# Altium project RK_NVR_DEMO1_RK3588_LP4XD200P232SD8_V21_20211228.PrjPcb (part 17 of 19)

## Sheet 84.PCIE-PCIE3.0_1x4Lanes_RC_64P.SchDoc
size 594 x 420 mm; Revision: V2.1; Schematic Page Number: 11; Page Number: 36; Check: Default; Schematic Name: RK_NVR_DEMO1_RK3588_LP4/4x_V21; Page Count: 43; Page name: 84.PCIE-PCIE3.0_1x4Lanes_RC_64P; Designer: Zhangdz; Schematic Page Count: 99; Revcode: V2.1; DsnPath: E:\Work\SBER\RK3588_SOM\temp\RK_NVR_DEMO1_RK3588_LP4XD200P232SD8_V21_20211228.DSN; SchematicName: RK_NVR_DEMO1_RK3588_LP4/4x_V21; PageName: 84.PCIE-PCIE3.0_1x4Lanes_RC_64P; PageSize: A2; TopSchematic: True
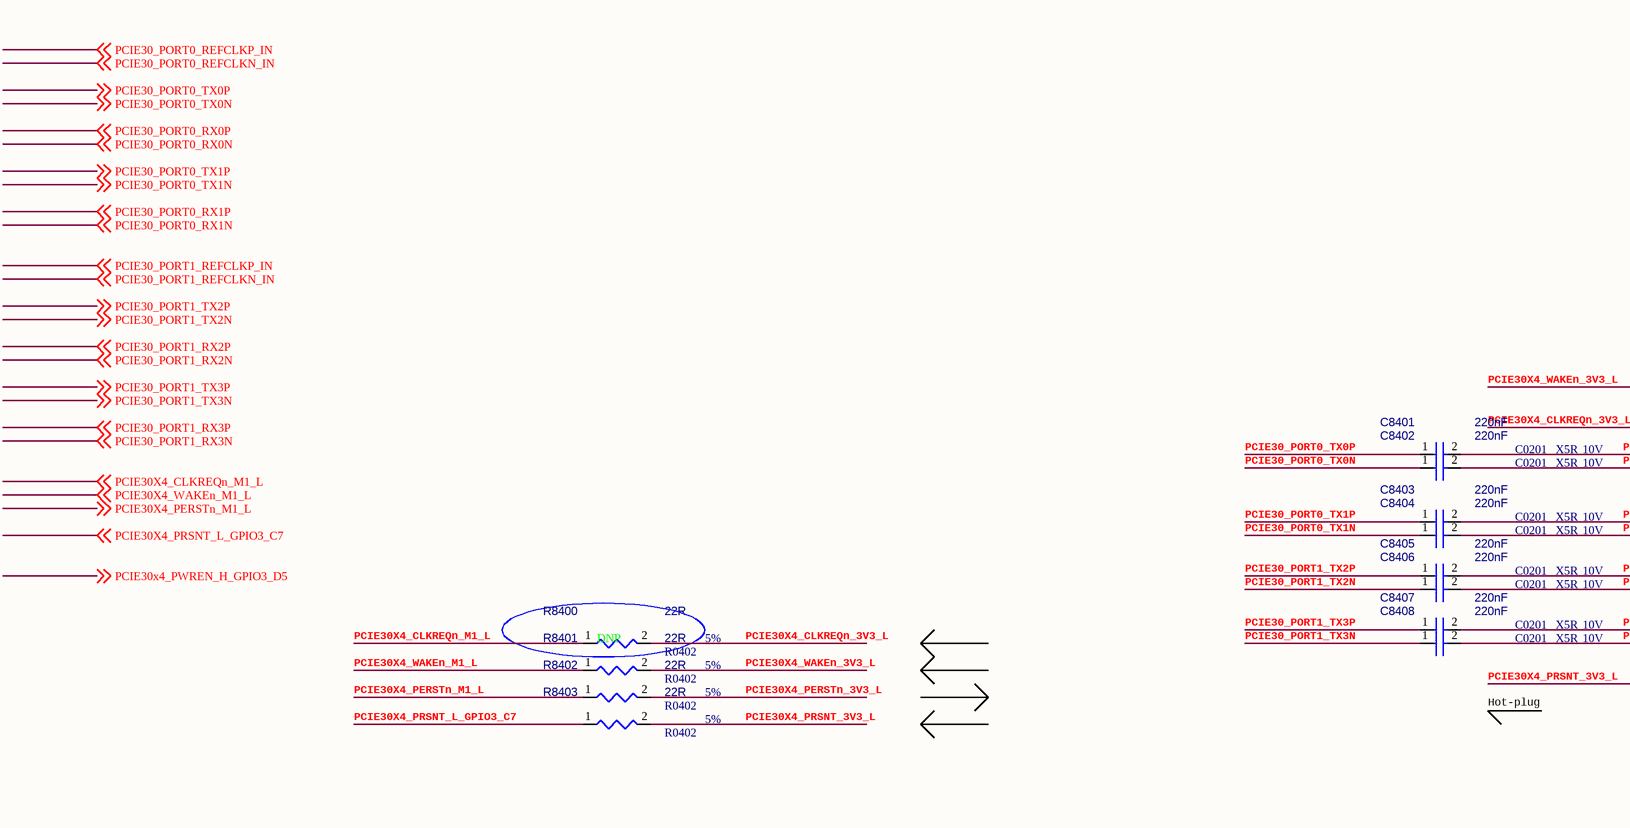
[diagram p69: 84.PCIE-PCIE3.0_1x4Lanes_RC_64P.SchDoc, top left]
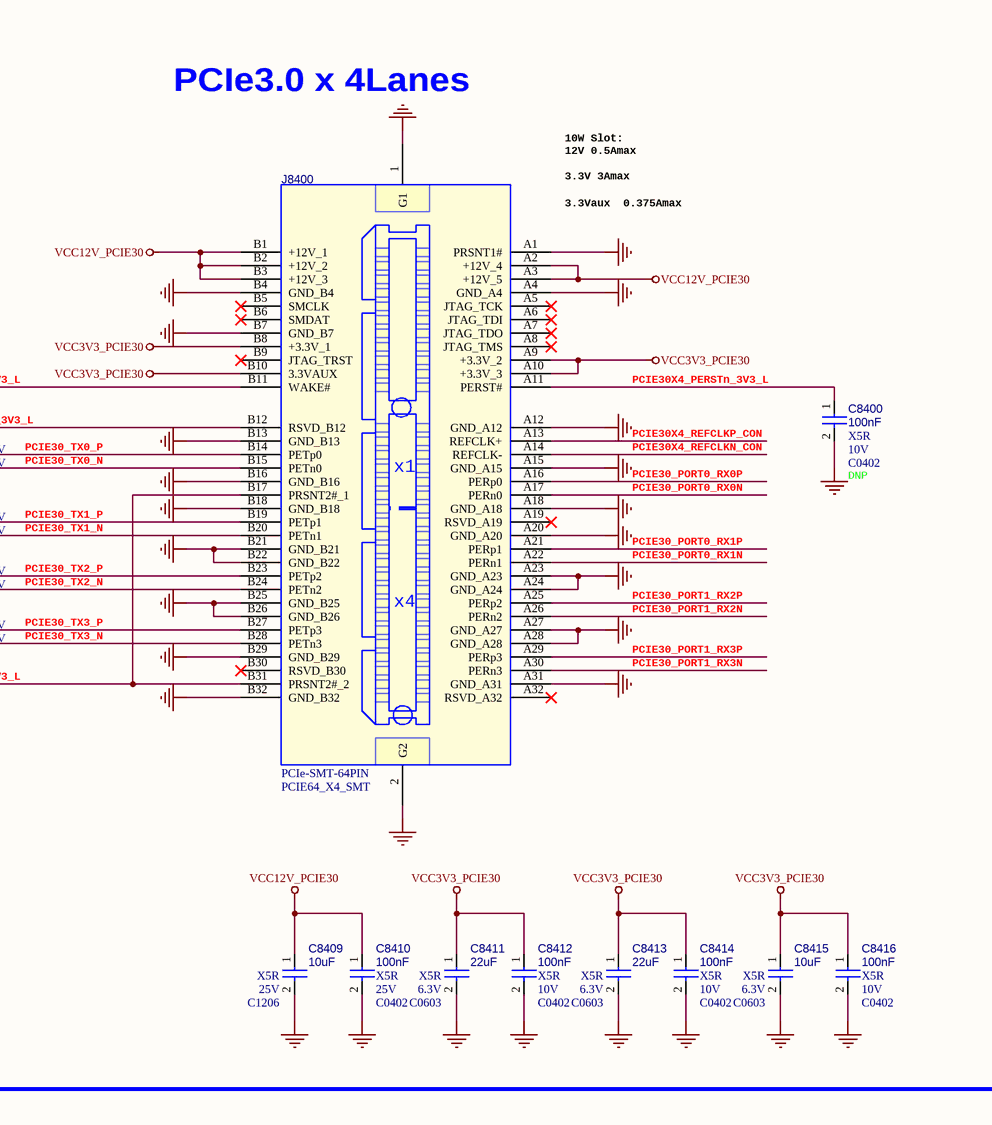
[diagram p70: 84.PCIE-PCIE3.0_1x4Lanes_RC_64P.SchDoc, top right]
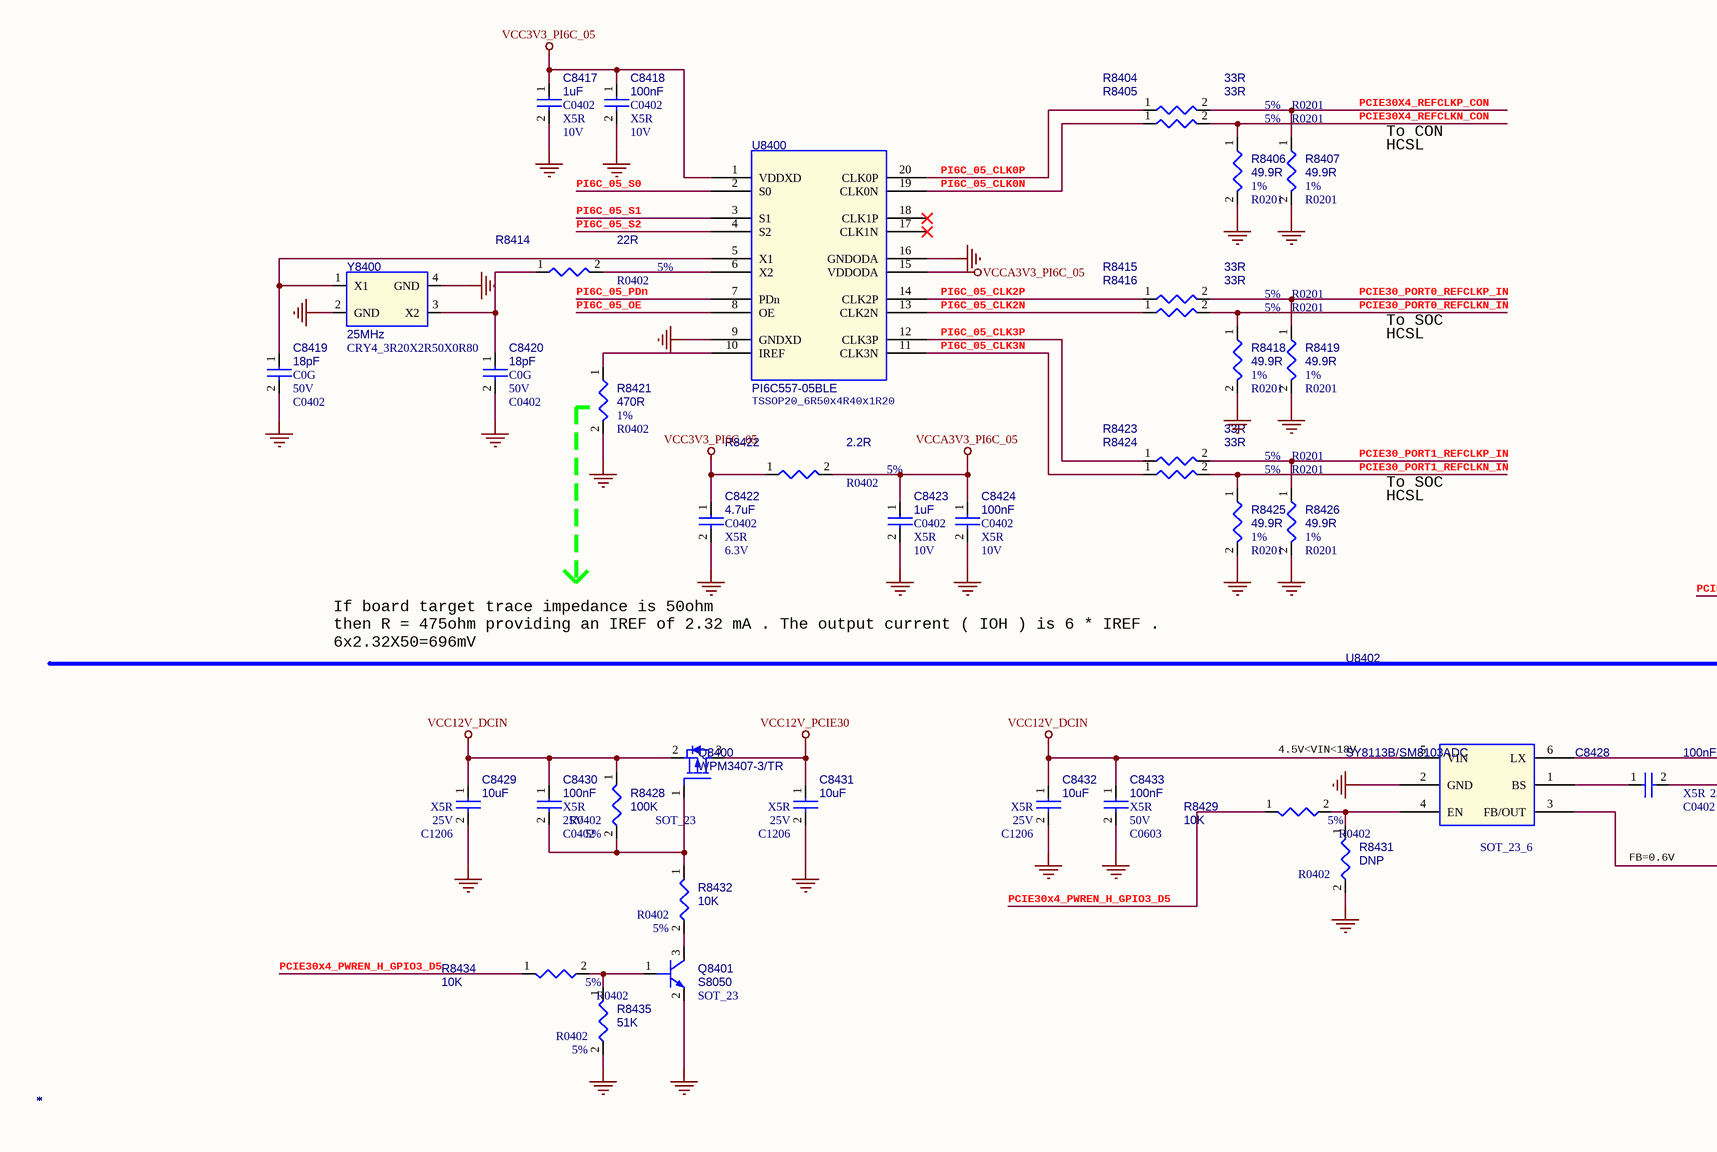
[diagram p71: 84.PCIE-PCIE3.0_1x4Lanes_RC_64P.SchDoc, bottom left]
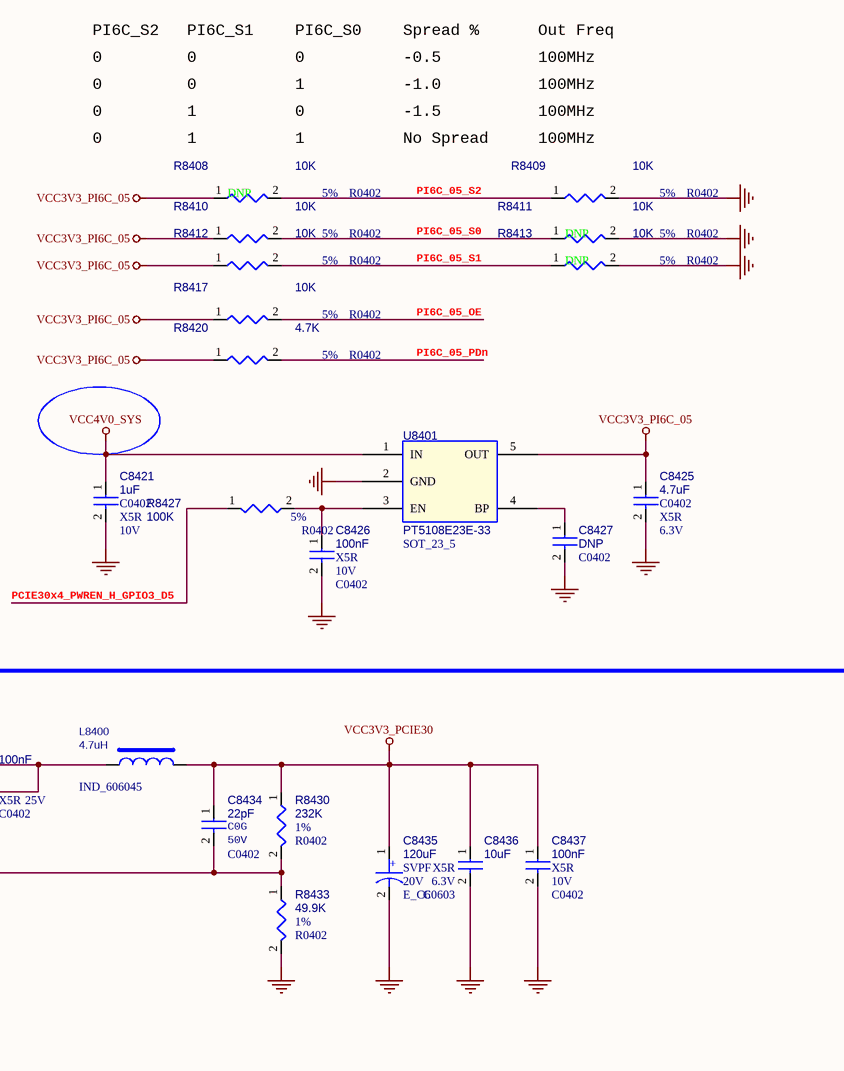
[diagram p72: 84.PCIE-PCIE3.0_1x4Lanes_RC_64P.SchDoc, bottom right]

### Parts
C8400  *  Voltage: 10V  Dielectric: X5R  option: DNP  [C0402]
C8401  *  Voltage: 10V  Dielectric: X5R  [C0201]
C8402  *  Voltage: 10V  Dielectric: X5R  [C0201]
C8403  *  Voltage: 10V  Dielectric: X5R  [C0201]
C8404  *  Voltage: 10V  Dielectric: X5R  [C0201]
C8405  *  Voltage: 10V  Dielectric: X5R  [C0201]
C8406  *  Voltage: 10V  Dielectric: X5R  [C0201]
C8407  *  Voltage: 10V  Dielectric: X5R  [C0201]
C8408  *  Voltage: 10V  Dielectric: X5R  [C0201]
C8409  *  Voltage: 25V  Dielectric: X5R  [C1206]
C8410  *  Voltage: 25V  Dielectric: X5R  [C0402]
C8411  *  Voltage: 6.3V  Dielectric: X5R  [C0603]
C8412  *  Voltage: 10V  Dielectric: X5R  [C0402]
C8413  *  Voltage: 6.3V  Dielectric: X5R  [C0603]
C8414  *  Voltage: 10V  Dielectric: X5R  [C0402]
C8415  *  Voltage: 6.3V  Dielectric: X5R  [C0603]
C8416  *  Voltage: 10V  Dielectric: X5R  [C0402]
C8417  *  Voltage: 10V  Dielectric: X5R  [C0402]
C8418  *  Voltage: 10V  Dielectric: X5R  [C0402]
C8419  *  Voltage: 50V  Dielectric: C0G  [C0402]
C8420  *  Voltage: 50V  Dielectric: C0G  [C0402]
C8421  *  Voltage: 10V  Dielectric: X5R  [C0402]
C8422  *  Voltage: 6.3V  Dielectric: X5R  [C0402]
C8423  *  Voltage: 10V  Dielectric: X5R  [C0402]
C8424  *  Voltage: 10V  Dielectric: X5R  [C0402]
C8425  *  Voltage: 6.3V  Dielectric: X5R  [C0402]
C8426  *  Voltage: 10V  Dielectric: X5R  [C0402]
C8427  *  [C0402]
C8428  *  Voltage: 25V  Dielectric: X5R  [C0402]
C8429  *  Voltage: 25V  Dielectric: X5R  [C1206]
C8430  *  Voltage: 25V  Dielectric: X5R  [C0402]
C8431  *  Voltage: 25V  Dielectric: X5R  [C1206]
C8432  *  Voltage: 25V  Dielectric: X5R  [C1206]
C8433  *  Voltage: 50V  Dielectric: X5R  [C0603]
C8434  *  Voltage: 50V  Dielectric: C0G  [C0402]
C8435  *  Voltage: 20V  Dielectric: SVPF  [E_C6]
C8436  *  Voltage: 6.3V  Dielectric: X5R  [C0603]
C8437  *  Voltage: 10V  Dielectric: X5R  [C0402]
J8400  *  [PCIE64_X4_SMT]
L8400  *  [IND_606045]
Q8400  *  PCB Footprint: SOT_23  [SOT23]
Q8401  *  [SOT_23]
R8400  *  Tolerance: 5%  option: DNP  [R0402]
R8401  *  Tolerance: 5%  [R0402]
R8402  *  Tolerance: 5%  [R0402]
R8403  *  Tolerance: 5%  [R0402]
R8404  *  PCB Footprint: R0201  Tolerance: 5%  [R0402]
R8405  *  PCB Footprint: R0201  Tolerance: 5%  [R0402]
R8406  *  PCB Footprint: R0201  Tolerance: 1%  [R0402]
R8407  *  PCB Footprint: R0201  Tolerance: 1%  [R0402]
R8408  *  Tolerance: 5%  option: DNP  [R0402]
R8409  *  Tolerance: 5%  [R0402]
R8410  *  Tolerance: 5%  [R0402]
R8411  *  Tolerance: 5%  option: DNP  [R0402]
R8412  *  Tolerance: 5%  [R0402]
R8413  *  Tolerance: 5%  option: DNP  [R0402]
R8414  *  Tolerance: 5%  [R0402]
R8415  *  PCB Footprint: R0201  Tolerance: 5%  [R0402]
R8416  *  PCB Footprint: R0201  Tolerance: 5%  [R0402]
R8417  *  Tolerance: 5%  [R0402]
R8418  *  PCB Footprint: R0201  Tolerance: 1%  [R0402]
R8419  *  PCB Footprint: R0201  Tolerance: 1%  [R0402]
R8420  *  Tolerance: 5%  [R0402]
R8421  *  Tolerance: 1%  [R0402]
R8422  *  Tolerance: 5%  [R0402]
R8423  *  PCB Footprint: R0201  Tolerance: 5%  [R0402]
R8424  *  PCB Footprint: R0201  Tolerance: 5%  [R0402]
R8425  *  PCB Footprint: R0201  Tolerance: 1%  [R0402]
R8426  *  PCB Footprint: R0201  Tolerance: 1%  [R0402]
R8427  *  Tolerance: 5%  [R0402]
R8428  *  Tolerance: 5%  [R0402]
R8429  *  Tolerance: 5%  [R0402]
R8430  *  Tolerance: 1%  [R0402]
R8431  *  [R0402]
R8432  *  Tolerance: 5%  [R0402]
R8433  *  Tolerance: 1%  [R0402]
R8434  *  Tolerance: 5%  [R0402]
R8435  *  Tolerance: 5%  [R0402]
U8400  *  PCB Footprint: TSSOP20_6R50x4R40x1R20  [TSSOP20]
U8401  *  [SOT_23_5]
U8402  *  [SOT_23_6]
Y8400  *  PCB Footprint: CRY4_3R20X2R50X0R80  [CRY-3225]

### Nets
GND: C8400.2 C8409.2 C8410.2 C8411.2 C8412.2 C8413.2 C8414.2 C8415.2 C8416.2 C8417.2 C8418.2 C8419.2 C8420.2 C8421.2 C8422.2 C8423.2 C8424.2 C8425.2 C8426.2 C8427.2 C8429.2 C8431.2 C8432.2 C8433.2 C8435.2 C8436.2 C8437.2 J8400.1(G1) J8400.2(G2) J8400.A1(PRSNT1#) J8400.A4(GND_A4) J8400.A12(GND_A12) J8400.A15(GND_A15) J8400.A18(GND_A18) J8400.A20(GND_A20) J8400.A23(GND_A23) J8400.A24(GND_A24) J8400.A27(GND_A27) J8400.A28(GND_A28) J8400.A31(GND_A31) J8400.B4(GND_B4) J8400.B7(GND_B7) J8400.B13(GND_B13) J8400.B16(GND_B16) J8400.B18(GND_B18) J8400.B21(GND_B21) J8400.B22(GND_B22) J8400.B25(GND_B25) J8400.B26(GND_B26) J8400.B29(GND_B29) J8400.B32(GND_B32) Q8401.2(EMITTER) R8406.2 R8407.2 R8409.2 R8411.2 R8413.2 R8418.2 R8419.2 R8421.2 R8425.2 R8426.2 R8431.2 R8433.2 R8435.2 U8400.9(GNDXD) U8400.16(GNDODA) U8401.2(GND) U8402.2(GND) Y8400.2(GND) Y8400.4(GND)
VCC3V3_PCIE30: C8411.1 C8412.1 C8413.1 C8414.1 C8415.1 C8416.1 C8434.1 C8435.1 C8436.1 C8437.1 J8400.A9(+3.3V_2) J8400.A10(+3.3V_3) J8400.B8(+3.3V_1) J8400.B10(3.3VAUX) L8400.2 R8430.1
VCC3V3_PI6C_05: C8417.1 C8418.1 C8422.1 C8425.1 R8408.1 R8410.1 R8412.1 R8417.1 R8420.1 R8422.1 U8400.1(VDDXD) U8401.5(OUT)
VCC4V0_SYS: C8421.1 U8401.1(IN)
VCC12V_DCIN: C8429.1 C8430.1 C8432.1 C8433.1 Q8400.2(SOURCE) R8428.1 U8402.5(VIN)
VCC12V_PCIE30: C8409.1 C8410.1 C8431.1 J8400.A2(+12V_4) J8400.A3(+12V_5) J8400.B1(+12V_1) J8400.B2(+12V_2) J8400.B3(+12V_3) Q8400.3(DRAIN)
VCCA3V3_PI6C_05: C8423.1 C8424.1 R8422.2 U8400.15(VDDODA)
PCIE30_PORT0_REFCLKN_IN: R8416.2 R8418.1 ; off-sheet PCIE30_PORT0_REFCLKN_IN
PCIE30_PORT0_REFCLKP_IN: R8415.2 R8419.1 ; off-sheet PCIE30_PORT0_REFCLKP_IN
PCIE30_PORT0_RX0N: J8400.A17(PERn0) ; off-sheet PCIE30_PORT0_RX0N
PCIE30_PORT0_RX0P: J8400.A16(PERp0) ; off-sheet PCIE30_PORT0_RX0P
PCIE30_PORT0_RX1N: J8400.A22(PERn1) ; off-sheet PCIE30_PORT0_RX1N
PCIE30_PORT0_RX1P: J8400.A21(PERp1) ; off-sheet PCIE30_PORT0_RX1P
PCIE30_PORT0_TX0N: C8402.1 ; off-sheet PCIE30_PORT0_TX0N
PCIE30_PORT0_TX0P: C8401.1 ; off-sheet PCIE30_PORT0_TX0P
PCIE30_PORT0_TX1N: C8404.1 ; off-sheet PCIE30_PORT0_TX1N
PCIE30_PORT0_TX1P: C8403.1 ; off-sheet PCIE30_PORT0_TX1P
PCIE30_PORT1_REFCLKN_IN: R8424.2 R8425.1 ; off-sheet PCIE30_PORT1_REFCLKN_IN
PCIE30_PORT1_REFCLKP_IN: R8423.2 R8426.1 ; off-sheet PCIE30_PORT1_REFCLKP_IN
PCIE30_PORT1_RX2N: J8400.A26(PERn2) ; off-sheet PCIE30_PORT1_RX2N
PCIE30_PORT1_RX2P: J8400.A25(PERp2) ; off-sheet PCIE30_PORT1_RX2P
PCIE30_PORT1_RX3N: J8400.A30(PERn3) ; off-sheet PCIE30_PORT1_RX3N
PCIE30_PORT1_RX3P: J8400.A29(PERp3) ; off-sheet PCIE30_PORT1_RX3P
PCIE30_PORT1_TX2N: C8406.1 ; off-sheet PCIE30_PORT1_TX2N
PCIE30_PORT1_TX2P: C8405.1 ; off-sheet PCIE30_PORT1_TX2P
PCIE30_PORT1_TX3N: C8408.1 ; off-sheet PCIE30_PORT1_TX3N
PCIE30_PORT1_TX3P: C8407.1 ; off-sheet PCIE30_PORT1_TX3P
PCIE30_TX0_N: C8402.2 J8400.B15(PETn0)
PCIE30_TX0_P: C8401.2 J8400.B14(PETp0)
PCIE30_TX1_N: C8404.2 J8400.B20(PETn1)
PCIE30_TX1_P: C8403.2 J8400.B19(PETp1)
PCIE30_TX2_N: C8406.2 J8400.B24(PETn2)
PCIE30_TX2_P: C8405.2 J8400.B23(PETp2)
PCIE30_TX3_N: C8408.2 J8400.B28(PETn3)
PCIE30_TX3_P: C8407.2 J8400.B27(PETp3)
PCIE30X4_CLKREQn_3V3_L: J8400.B12(RSVD_B12) R8400.2
PCIE30X4_CLKREQn_M1_L: R8400.1 ; off-sheet PCIE30X4_CLKREQn_M1_L
PCIE30X4_PERSTn_3V3_L: C8400.1 J8400.A11(PERST#) R8402.2
PCIE30X4_PERSTn_M1_L: R8402.1 ; off-sheet PCIE30X4_PERSTn_M1_L
PCIE30X4_PRSNT_3V3_L: J8400.B17(PRSNT2#_1) J8400.B31(PRSNT2#_2) R8403.2
PCIE30X4_PRSNT_L_GPIO3_C7: R8403.1 ; off-sheet PCIE30X4_PRSNT_L_GPIO3_C7
PCIE30x4_PWREN_H_GPIO3_D5: R8427.1 R8429.1 R8434.1 ; off-sheet PCIE30x4_PWREN_H_GPIO3_D5
PCIE30X4_REFCLKN_CON: J8400.A14(REFCLK-) R8405.2 R8406.1
PCIE30X4_REFCLKP_CON: J8400.A13(REFCLK+) R8404.2 R8407.1
PCIE30X4_WAKEn_3V3_L: J8400.B11(WAKE#) R8401.2
PCIE30X4_WAKEn_M1_L: R8401.1 ; off-sheet PCIE30X4_WAKEn_M1_L
PI6C_05_CLK0N: R8405.1 U8400.19(CLK0N)
PI6C_05_CLK0P: R8404.1 U8400.20(CLK0P)
PI6C_05_CLK2N: R8416.1 U8400.13(CLK2N)
PI6C_05_CLK2P: R8415.1 U8400.14(CLK2P)
PI6C_05_CLK3N: R8424.1 U8400.11(CLK3N)
PI6C_05_CLK3P: R8423.1 U8400.12(CLK3P)
PI6C_05_OE: R8417.2 U8400.8(OE)
PI6C_05_PDn: R8420.2 U8400.7(PDn)
PI6C_05_S0: R8410.2 R8411.1 U8400.2(S0)
PI6C_05_S1: R8412.2 R8413.1 U8400.3(S1)
PI6C_05_S2: R8408.2 R8409.1 U8400.4(S2)
NetC8419_1: C8419.1 U8400.5(X1) Y8400.1(X1)
NetC8420_1: C8420.1 R8414.1 Y8400.3(X2)
NetC8426_1: C8426.1 R8427.2 U8401.3(EN)
NetC8427_1: C8427.1 U8401.4(BP)
NetC8428_1: C8428.1 U8402.1(BS)
NetC8428_2: C8428.2 L8400.1 U8402.6(LX)
NetC8430_2: C8430.2 Q8400.1(GATE) R8428.2 R8432.1
NetC8434_2: C8434.2 R8430.2 R8433.1 U8402.3(FB/OUT)
NetQ8401_1: Q8401.1(BASE) R8434.2 R8435.1
NetQ8401_3: Q8401.3(COLLECTOR) R8432.2
NetR8414_2: R8414.2 U8400.6(X2)
NetR8421_1: R8421.1 U8400.10(IREF)
NetR8429_2: R8429.2 R8431.1 U8402.4(EN)

Not connected (* = marked no-connect by the designer): J8400 A5(JTAG_TCK)* A6(JTAG_TDI)* A7(JTAG_TDO)* A8(JTAG_TMS)* A19(RSVD_A19)* A32(RSVD_A32)* B5(SMCLK)* B6(SMDAT)* B9(JTAG_TRST)* B30(RSVD_B30)*; U8400 17(CLK1N)* 18(CLK1P)*

### Notes on the sheet
- PCIe3.0 x 4Lanes
- 10W Slot:
  12V 0.5Amax
- 3.3V 3Amax
- 3.3Vaux  0.375Amax
- Hot-plug
- PI6C_S2
- 0
- PI6C_S1
- PI6C_S0
- Spread %
- -0.5
- Out Freq
- 100MHz
- 1
- -1.0
- -1.5
- To CON
- HCSL
- No Spread
- (near R8409) 100MHz
- To SOC
- If board target trace impedance is 50ohm
  then R = 475ohm providing an IREF of 2.32 mA . The output current ( IOH ) is 6 * IREF .
  6x2.32X50=696mV
- 4.5V<VIN<18V
- FB=0.6V
- (in symbol CAP) +
- (in symbol PCIeX4_1) x1; x4

### Library data of the parts
C8400 = CAP NP: cap,100.00nF,+/-10%,10V,X5R,C0402; Part Reference: C8400; Manufacturer: TDK; Value: 100nF; RK PN: C1005X5R1A104K050BA; Priority: A; Tolerance: 10%; PCB Footprint: C0402; Part Type: C0402; Manufacturer PN: C1005X5R1A104K050BA; Created by: JJJ
C8401 = CAP NP: cap,220.00nF,+/-10%,10V,X5R,C0201; Part Reference: C8401; Manufacturer PN: C0603X5R1A224K030BB; Manufacturer: TDK; Value: 220nF; Tolerance: 10%; Priority: A; PCB Footprint: C0201; Created by: JJJ; Part Type: C0201; RK PN: C0603X5R1A224K030BB
C8402 = CAP NP: cap,220.00nF,+/-10%,10V,X5R,C0201; Part Reference: C8402; Manufacturer PN: C0603X5R1A224K030BB; Manufacturer: TDK; Value: 220nF; Tolerance: 10%; Priority: A; PCB Footprint: C0201; Created by: JJJ; Part Type: C0201; RK PN: C0603X5R1A224K030BB
C8403 = CAP NP: cap,220.00nF,+/-10%,10V,X5R,C0201; Part Reference: C8403; Manufacturer PN: C0603X5R1A224K030BB; Manufacturer: TDK; Value: 220nF; Tolerance: 10%; Priority: A; PCB Footprint: C0201; Created by: JJJ; Part Type: C0201; RK PN: C0603X5R1A224K030BB
C8404 = CAP NP: cap,220.00nF,+/-10%,10V,X5R,C0201; Part Reference: C8404; Manufacturer PN: C0603X5R1A224K030BB; Manufacturer: TDK; Value: 220nF; Tolerance: 10%; Priority: A; PCB Footprint: C0201; Created by: JJJ; Part Type: C0201; RK PN: C0603X5R1A224K030BB
C8405 = CAP NP: cap,220.00nF,+/-10%,10V,X5R,C0201; Part Reference: C8405; Manufacturer PN: C0603X5R1A224K030BB; Manufacturer: TDK; Value: 220nF; Tolerance: 10%; Priority: A; PCB Footprint: C0201; Created by: JJJ; Part Type: C0201; RK PN: C0603X5R1A224K030BB
C8406 = CAP NP: cap,220.00nF,+/-10%,10V,X5R,C0201; Part Reference: C8406; Manufacturer PN: C0603X5R1A224K030BB; Manufacturer: TDK; Value: 220nF; Tolerance: 10%; Priority: A; PCB Footprint: C0201; Created by: JJJ; Part Type: C0201; RK PN: C0603X5R1A224K030BB
C8407 = CAP NP: cap,220.00nF,+/-10%,10V,X5R,C0201; Part Reference: C8407; Manufacturer PN: C0603X5R1A224K030BB; Manufacturer: TDK; Value: 220nF; Tolerance: 10%; Priority: A; PCB Footprint: C0201; Created by: JJJ; Part Type: C0201; RK PN: C0603X5R1A224K030BB
C8408 = CAP NP: cap,220.00nF,+/-10%,10V,X5R,C0201; Part Reference: C8408; Manufacturer PN: C0603X5R1A224K030BB; Manufacturer: TDK; Value: 220nF; Tolerance: 10%; Priority: A; PCB Footprint: C0201; Created by: JJJ; Part Type: C0201; RK PN: C0603X5R1A224K030BB
C8409 = CAP NP: cap,10.00uF,+/-10%,25V,X5R,C1206; Part Reference: C8409; Manufacturer PN: C3216X5R1E106K085AC; Manufacturer: TDK; Value: 10uF; Tolerance: 10%; C_Voltage: 6.3V; Priority: A; PCB Footprint: C1206; Created by: JJJ; Part Type: C1206; RK PN: C3216X5R1E106K085AC
C8410 = CAP NP: cap,100.00nF,+/-10%,25V,X5R,C0402; Part Reference: C8410; Manufacturer: TDK; Value: 100nF; Number: 37; RK PN: C1005X5R1E104K050BC; Priority: A; Tolerance: 10%; C_Voltage: 6.3V; PCB Footprint: C0402; Part Type: C0402; Manufacturer PN: C1005X5R1E104K050BC; Created by: JJJ
C8411 = CAP NP: cap,22.00uF,+/-20%,6.3V,X5R,C0603; Part Reference: C8411; Manufacturer PN: C1608X5R0J226M080AC; Manufacturer: TDK; Value: 22uF; Tolerance: 20%; Priority: A; PCB Footprint: C0603; Created by: JJJ; C_Voltage: 6.3V; Part Type: C0603; RK PN: C1608X5R0J226M080AC
C8412 = CAP NP: cap,100.00nF,+/-10%,10V,X5R,C0402; Part Reference: C8412; Manufacturer PN: C1005X5R1A104K050BA; Manufacturer: TDK; Value: 100nF; C_Voltage: 6.3V; Tolerance: 10%; Priority: A; Number: 37; PCB Footprint: C0402; Created by: JJJ; Part Type: C0402; RK PN: C1005X5R1A104K050BA
C8413 = CAP NP: cap,22.00uF,+/-20%,6.3V,X5R,C0603; Part Reference: C8413; Manufacturer PN: C1608X5R0J226M080AC; Manufacturer: TDK; Value: 22uF; Tolerance: 20%; Priority: A; PCB Footprint: C0603; Created by: JJJ; C_Voltage: 6.3V; Part Type: C0603; RK PN: C1608X5R0J226M080AC
C8414 = CAP NP: cap,100.00nF,+/-10%,10V,X5R,C0402; Part Reference: C8414; Manufacturer PN: C1005X5R1A104K050BA; Manufacturer: TDK; Value: 100nF; C_Voltage: 6.3V; Tolerance: 10%; Priority: A; Number: 37; PCB Footprint: C0402; Created by: JJJ; Part Type: C0402; RK PN: C1005X5R1A104K050BA
C8415 = CAP NP: cap,10.00uF,+/-10%,6.3V,X5R,C0603; Part Reference: C8415; Manufacturer: TDK; Value: 10uF; RK PN: C1608X5R0J106K080AB; Priority: A; Tolerance: 10%; PCB Footprint: C0603; Part Type: C0603; C_Voltage: 6.3V; Manufacturer PN: C1608X5R0J106K080AB; Created by: JJJ
C8416 = CAP NP: cap,100.00nF,+/-10%,10V,X5R,C0402; Part Reference: C8416; Manufacturer: TDK; Value: 100nF; Number: 37; RK PN: C1005X5R1A104K050BA; Priority: A; Tolerance: 10%; C_Voltage: 6.3V; PCB Footprint: C0402; Part Type: C0402; Manufacturer PN: C1005X5R1A104K050BA; Created by: JJJ
C8417 = CAP NP: cap,1.00uF,+/-10%,10V,X5R,C0402; Part Reference: C8417; Manufacturer PN: C1005X5R1A105K050BB; Manufacturer: TDK; Value: 1uF; Tolerance: 10%; Priority: A; PCB Footprint: C0402; Created by: JJJ; Part Type: C0402; RK PN: C1005X5R1A105K050BB
C8418 = CAP NP: cap,100.00nF,+/-10%,10V,X5R,C0402; Part Reference: C8418; Manufacturer: TDK; Value: 100nF; RK PN: C1005X5R1A104K050BA; Priority: A; Tolerance: 10%; PCB Footprint: C0402; Part Type: C0402; Manufacturer PN: C1005X5R1A104K050BA; Created by: JJJ
C8419 = CAP NP: cap,18.00pF,+/-5%,50V,C0G,C0402; Part Reference: C8419; Manufacturer: TDK; Value: 18pF; Number: 37; RK PN: C1005C0G1H180J050BA; Priority: A; Tolerance: 5%; C_Voltage: 6.3V; PCB Footprint: C0402; Part Type: C0402; Manufacturer PN: C1005C0G1H180J050BA; Created by: JJJ
C8420 = CAP NP: cap,18.00pF,+/-5%,50V,C0G,C0402; Part Reference: C8420; Manufacturer PN: C1005C0G1H180J050BA; Manufacturer: TDK; Value: 18pF; C_Voltage: 6.3V; Tolerance: 5%; Priority: A; Number: 37; PCB Footprint: C0402; Created by: JJJ; Part Type: C0402; RK PN: C1005C0G1H180J050BA
C8421 = CAP NP: cap,1.00uF,+/-10%,10V,X5R,C0402; Part Reference: C8421; Manufacturer: TDK; Value: 1uF; RK PN: C1005X5R1A105K050BB; Priority: A; Tolerance: 10%; PCB Footprint: C0402; Part Type: C0402; Manufacturer PN: C1005X5R1A105K050BB; Created by: JJJ
C8422 = CAP NP: cap,4.70uF,+/-10%,6.3V,X5R,C0402; Part Reference: C8422; Manufacturer: TDK; Value: 4.7uF; RK PN: C1005X5R0J475K050BC; Priority: A; Tolerance: 10%; PCB Footprint: C0402; Part Type: C0402; Manufacturer PN: C1005X5R0J475K050BC; Created by: JJJ
C8423 = CAP NP: cap,1.00uF,+/-10%,10V,X5R,C0402; Part Reference: C8423; Manufacturer PN: C1005X5R1A105K050BB; Manufacturer: TDK; Value: 1uF; Tolerance: 10%; Priority: A; PCB Footprint: C0402; Created by: JJJ; Part Type: C0402; RK PN: C1005X5R1A105K050BB
C8424 = CAP NP: cap,100.00nF,+/-10%,10V,X5R,C0402; Part Reference: C8424; Manufacturer: TDK; Value: 100nF; RK PN: C1005X5R1A104K050BA; Priority: A; Tolerance: 10%; PCB Footprint: C0402; Part Type: C0402; Manufacturer PN: C1005X5R1A104K050BA; Created by: JJJ
C8425 = CAP NP: cap,4.70uF,+/-10%,6.3V,X5R,C0402; Part Reference: C8425; Manufacturer PN: C1005X5R0J475K050BC; Manufacturer: TDK; Value: 4.7uF; Tolerance: 10%; Priority: A; PCB Footprint: C0402; Created by: JJJ; Part Type: C0402; RK PN: C1005X5R0J475K050BC
C8426 = CAP NP: cap,100.00nF,+/-10%,10V,X5R,C0402; Part Reference: C8426; Manufacturer: TDK; Value: 100nF; Number: 37; RK PN: C1005X5R1A104K050BA; Priority: A; Tolerance: 10%; C_Voltage: 6.3V; PCB Footprint: C0402; Part Type: C0402; Manufacturer PN: C1005X5R1A104K050BA; Created by: JJJ
C8427 = CAP NP: Did Not Place.; Part Reference: C8427; Manufacturer PN: DNPC0402; Value: DNP; Priority: A; PCB Footprint: C0402; Created by: JJJ; Part Type: DNP; RK PN: DNPC0402
C8428 = CAP NP: cap,100.00nF,+/-10%,25V,X5R,C0402; Part Reference: C8428; Manufacturer: TDK; Value: 100nF; Number: 37; RK PN: C1005X5R1E104K050BC; Priority: A; Tolerance: 10%; C_Voltage: 6.3V; PCB Footprint: C0402; Part Type: C0402; Manufacturer PN: C1005X5R1E104K050BC; Created by: JJJ
C8429 = CAP NP: cap,10.00uF,+/-10%,25V,X5R,C1206; Part Reference: C8429; Manufacturer: TDK; Value: 10uF; RK PN: C3216X5R1E106K085AC; Priority: A; C_Voltage: 6.3V; Tolerance: 10%; PCB Footprint: C1206; Part Type: C1206; Manufacturer PN: C3216X5R1E106K085AC; Created by: JJJ
C8430 = CAP NP: cap,100.00nF,+/-10%,25V,X5R,C0402; Part Reference: C8430; Manufacturer PN: C1005X5R1E104K050BC; Manufacturer: TDK; Value: 100nF; C_Voltage: 6.3V; Tolerance: 10%; Priority: A; Number: 37; PCB Footprint: C0402; Created by: JJJ; Part Type: C0402; RK PN: C1005X5R1E104K050BC
C8431 = CAP NP: cap,10.00uF,+/-10%,25V,X5R,C1206; Part Reference: C8431; Manufacturer: TDK; Value: 10uF; RK PN: C3216X5R1E106K085AC; Priority: A; C_Voltage: 6.3V; Tolerance: 10%; PCB Footprint: C1206; Part Type: C1206; Manufacturer PN: C3216X5R1E106K085AC; Created by: JJJ
C8432 = CAP NP: cap,10.00uF,+/-10%,25V,X5R,C1206; Part Reference: C8432; Manufacturer PN: C3216X5R1E106K085AC; Manufacturer: TDK; Value: 10uF; Tolerance: 10%; C_Voltage: 6.3V; Priority: A; PCB Footprint: C1206; Created by: JJJ; Part Type: C1206; RK PN: C3216X5R1E106K085AC
C8433 = CAP NP: cap,100.00nF,+/-10%,50V,X5R,C0603; Part Reference: C8433; Manufacturer PN: C1608X5R1H104K080AA; Manufacturer: TDK; Value: 100nF; Tolerance: 10%; Priority: A; PCB Footprint: C0603; Created by: JJJ; Part Type: C0603; RK PN: C1608X5R1H104K080AA
C8434 = CAP NP: cap,22.00pF,+/-5%,50V,C0G,C0402; Part Reference: C8434; Manufacturer: TDK; Value: 22pF; RK PN: C1005C0G1H220J050BA; Priority: A; Tolerance: 5%; PCB Footprint: C0402; Part Type: C0402; Manufacturer PN: C1005C0G1H220J050BA; Created by: JJJ
C8435 = CAP: 120uF,20V,25mR,SVPF; Part Reference: C8435; Manufacturer PN: 25SVPF100M; Manufacturer: Panasonic; Tolerance: 20%; Priority: A; PCB Footprint: E_C6; Value: 120uF; Created by: JJJ; Part Type: МщЖ¬№ММ¬ВБµзЅв; RK PN: 25SVPF100M
C8436 = CAP NP: cap,10.00uF,+/-10%,6.3V,X5R,C0603; Part Reference: C8436; Manufacturer: TDK; Value: 10uF; RK PN: C1608X5R0J106K080AB; Priority: A; Tolerance: 10%; PCB Footprint: C0603; Part Type: C0603; C_Voltage: 6.3V; Manufacturer PN: C1608X5R0J106K080AB; Created by: JJJ
C8437 = CAP NP: cap,100.00nF,+/-10%,10V,X5R,C0402; Part Reference: C8437; Manufacturer PN: C1005X5R1A104K050BA; Manufacturer: TDK; Value: 100nF; C_Voltage: 6.3V; Tolerance: 10%; Priority: A; Number: 37; PCB Footprint: C0402; Created by: JJJ; Part Type: C0402; RK PN: C1005X5R1A104K050BA
J8400 = PCIeX4_1: Part Reference: J8400; Value: PCIe-SMT-64PIN; PCB Footprint: PCIE64_X4_SMT
L8400 = INDUCTORS OF FERRITE_Dup1: Power Inductor,4.7uH,0.2,IND_606045; Part Reference: L8400; Manufacturer PN: SWPA6045S4R7MT; Manufacturer: sunlord; Isat: 4.97A; DC Resistor: 0.02ohm; Resonace frequency: 24M; Irms: 3.3A; Tolerance: 20%; Priority: A; PCB Footprint: IND_606045; Value: 4.7uH; Created by: YWQ; Part Type: POWER_IND; RK PN: SWPA6045S4R7MT
Q8400 = MOSFET P: PMOS,WPM3407-3/TR,SOT_23,Id=4.4A,Vds=30V; Part Reference: Q8400; Manufacturer: WillSemi(О¤¶ы°лµјМе); Priority: A; Id_max: 4.4A; Vgs: ЎА20V; VDS: 30V; Vgsth: 2.0V; Pd: 0.9W; Value: WPM3407-3/TR; RK PN: WPM3407-3/TR; Part Type: PMOS; Manufacturer PN: WPM3407-3/TR; Created by: JJJ
Q8401 = NPN: S8050,SOT23; Part Reference: Q8401; Manufacturer: і¤µз; Manufacturer PN: S8050_SOT23; Priority: A; Ic: 0.5A; Vceo: 25V; Pc: 0.3W; PCB Footprint: SOT_23; Value: S8050; RK PN: S8050; Part Type: NPN; Created by: JJJ
R8400 = RESISTOR_Dup1: НЁУГєсД¤µзЧи,22R,+/-5%,R0402,1/16W.; Part Reference: R8400; Manufacturer PN: RC0402JR-0722RL; Manufacturer: YAGEO; Wattage: 1/16W; Priority: A; PCB Footprint: R0402; Value: 22R; Created by: YTL; Part Type: НЁУГєсД¤µзЧи; RK PN: RC0402JR-0722RL
R8401 = RESISTOR_Dup1: НЁУГєсД¤µзЧи,22R,+/-5%,R0402,1/16W.; Part Reference: R8401; Manufacturer: YAGEO; RK PN: RC0402JR-0722RL; Priority: A; Wattage: 1/16W; PCB Footprint: R0402; Value: 22R; Part Type: НЁУГєсД¤µзЧи; Manufacturer PN: RC0402JR-0722RL; Created by: YTL
R8402 = RESISTOR_Dup1: НЁУГєсД¤µзЧи,22R,+/-5%,R0402,1/16W.; Part Reference: R8402; Manufacturer PN: RC0402JR-0722RL; Manufacturer: YAGEO; Wattage: 1/16W; Priority: A; PCB Footprint: R0402; Value: 22R; Created by: YTL; Part Type: НЁУГєсД¤µзЧи; RK PN: RC0402JR-0722RL
R8403 = RESISTOR_Dup1: НЁУГєсД¤µзЧи,22R,+/-5%,R0402,1/16W.; Part Reference: R8403; Manufacturer: YAGEO; RK PN: RC0402JR-0722RL; Priority: A; Wattage: 1/16W; PCB Footprint: R0402; Value: 22R; Part Type: НЁУГєсД¤µзЧи; Manufacturer PN: RC0402JR-0722RL; Created by: YTL
R8404 = RESISTOR_Dup1: НЁУГєсД¤µзЧи,33R,+/-5%,R0201,1/20W.; Part Reference: R8404; Manufacturer: YAGEO; RK PN: RC0201JR-0733RL; Priority: A; Wattage: 1/20W; Value: 33R; Part Type: НЁУГєсД¤µзЧи; Manufacturer PN: RC0201JR-0733RL; Created by: YTL
R8405 = RESISTOR_Dup1: НЁУГєсД¤µзЧи,33R,+/-5%,R0201,1/20W.; Part Reference: R8405; Manufacturer: YAGEO; RK PN: RC0201JR-0733RL; Priority: A; Wattage: 1/20W; Value: 33R; Part Type: НЁУГєсД¤µзЧи; Manufacturer PN: RC0201JR-0733RL; Created by: YTL
R8406 = RESISTOR_Dup1: НЁУГєсД¤µзЧи,49R9,+/-1%,R0201,1/20W.; Part Reference: R8406; Manufacturer PN: RC0201FR-0749R9L; Manufacturer: YAGEO; Value: 49.9R; Wattage: 1/20W; Priority: A; Created by: YTL; Part Type: НЁУГєсД¤µзЧи; RK PN: RC0201FR-0749R9L
R8407 = RESISTOR_Dup1: НЁУГєсД¤µзЧи,49R9,+/-1%,R0201,1/20W.; Part Reference: R8407; Manufacturer PN: RC0201FR-0749R9L; Manufacturer: YAGEO; Value: 49.9R; Wattage: 1/20W; Priority: A; Created by: YTL; Part Type: НЁУГєсД¤µзЧи; RK PN: RC0201FR-0749R9L
R8408 = RESISTOR_Dup1: НЁУГєсД¤µзЧи,10K,+/-5%,R0402,1/16W.; Part Reference: R8408; Manufacturer: YAGEO; RK PN: RC0402JR-0710KL; Priority: A; Wattage: 1/16W; PCB Footprint: R0402; Value: 10K; Part Type: НЁУГєсД¤µзЧи; Manufacturer PN: RC0402JR-0710KL; Created by: YTL
R8409 = RESISTOR_Dup1: НЁУГєсД¤µзЧи,10K,+/-5%,R0402,1/16W.; Part Reference: R8409; Manufacturer: YAGEO; RK PN: RC0402JR-0710KL; Priority: A; Wattage: 1/16W; PCB Footprint: R0402; Value: 10K; Part Type: НЁУГєсД¤µзЧи; Manufacturer PN: RC0402JR-0710KL; Created by: YTL
R8410 = RESISTOR_Dup1: НЁУГєсД¤µзЧи,10K,+/-5%,R0402,1/16W.; Part Reference: R8410; Manufacturer: YAGEO; RK PN: RC0402JR-0710KL; Priority: A; Wattage: 1/16W; PCB Footprint: R0402; Value: 10K; Part Type: НЁУГєсД¤µзЧи; Manufacturer PN: RC0402JR-0710KL; Created by: YTL
R8411 = RESISTOR_Dup1: НЁУГєсД¤µзЧи,10K,+/-5%,R0402,1/16W.; Part Reference: R8411; Manufacturer: YAGEO; RK PN: RC0402JR-0710KL; Priority: A; Wattage: 1/16W; PCB Footprint: R0402; Value: 10K; Part Type: НЁУГєсД¤µзЧи; Manufacturer PN: RC0402JR-0710KL; Created by: YTL
R8412 = RESISTOR_Dup1: НЁУГєсД¤µзЧи,10K,+/-5%,R0402,1/16W.; Part Reference: R8412; Manufacturer: YAGEO; RK PN: RC0402JR-0710KL; Priority: A; Wattage: 1/16W; PCB Footprint: R0402; Value: 10K; Part Type: НЁУГєсД¤µзЧи; Manufacturer PN: RC0402JR-0710KL; Created by: YTL
R8413 = RESISTOR_Dup1: НЁУГєсД¤µзЧи,10K,+/-5%,R0402,1/16W.; Part Reference: R8413; Manufacturer PN: RC0402JR-0710KL; Manufacturer: YAGEO; Wattage: 1/16W; Priority: A; PCB Footprint: R0402; Value: 10K; Created by: YTL; Part Type: НЁУГєсД¤µзЧи; RK PN: RC0402JR-0710KL
R8414 = RESISTOR_Dup1: НЁУГєсД¤µзЧи,22R,+/-5%,R0402,1/16W.; Part Reference: R8414; Manufacturer: YAGEO; RK PN: RC0402JR-0722RL; Priority: A; Wattage: 1/16W; PCB Footprint: R0402; Value: 22R; Part Type: НЁУГєсД¤µзЧи; Manufacturer PN: RC0402JR-0722RL; Created by: YTL
R8415 = RESISTOR_Dup1: НЁУГєсД¤µзЧи,33R,+/-5%,R0201,1/20W.; Part Reference: R8415; Manufacturer PN: RC0201JR-0733RL; Manufacturer: YAGEO; Wattage: 1/20W; Priority: A; Value: 33R; Created by: YTL; Part Type: НЁУГєсД¤µзЧи; RK PN: RC0201JR-0733RL
R8416 = RESISTOR_Dup1: НЁУГєсД¤µзЧи,33R,+/-5%,R0201,1/20W.; Part Reference: R8416; Manufacturer PN: RC0201JR-0733RL; Manufacturer: YAGEO; Wattage: 1/20W; Priority: A; Value: 33R; Created by: YTL; Part Type: НЁУГєсД¤µзЧи; RK PN: RC0201JR-0733RL
R8417 = RESISTOR_Dup1: НЁУГєсД¤µзЧи,10K,+/-5%,R0402,1/16W.; Part Reference: R8417; Manufacturer: YAGEO; RK PN: RC0402JR-0710KL; Priority: A; Wattage: 1/16W; PCB Footprint: R0402; Value: 10K; Part Type: НЁУГєсД¤µзЧи; Manufacturer PN: RC0402JR-0710KL; Created by: YTL
R8418 = RESISTOR_Dup1: НЁУГєсД¤µзЧи,49R9,+/-1%,R0201,1/20W.; Part Reference: R8418; Manufacturer PN: RC0201FR-0749R9L; Manufacturer: YAGEO; Value: 49.9R; Wattage: 1/20W; Priority: A; Created by: YTL; Part Type: НЁУГєсД¤µзЧи; RK PN: RC0201FR-0749R9L
R8419 = RESISTOR_Dup1: НЁУГєсД¤µзЧи,49R9,+/-1%,R0201,1/20W.; Part Reference: R8419; Manufacturer PN: RC0201FR-0749R9L; Manufacturer: YAGEO; Value: 49.9R; Wattage: 1/20W; Priority: A; Created by: YTL; Part Type: НЁУГєсД¤µзЧи; RK PN: RC0201FR-0749R9L
R8420 = RESISTOR_Dup1: НЁУГєсД¤µзЧи,4K7,+/-5%,R0402,1/16W.; Part Reference: R8420; Manufacturer: YAGEO; Value: 4.7K; RK PN: RC0402JR-074K7L; Priority: A; Wattage: 1/16W; PCB Footprint: R0402; Part Type: НЁУГєсД¤µзЧи; Manufacturer PN: RC0402JR-074K7L; Created by: YTL
R8421 = RESISTOR_Dup1: НЁУГєсД¤µзЧи,470R,+/-1%,R0402,1/16W.; Part Reference: R8421; Manufacturer PN: RC0402FR-07470RL; Manufacturer: YAGEO; Wattage: 1/16W; Priority: A; PCB Footprint: R0402; Value: 470R; Created by: YTL; Part Type: НЁУГєсД¤µзЧи; RK PN: RC0402FR-07470RL
R8422 = RESISTOR_Dup1: НЁУГєсД¤µзЧи,2R2,+/-5%,R0402,1/16W.; Part Reference: R8422; Manufacturer PN: RC0402JR-072R2L; Manufacturer: YAGEO; Value: 2.2R; Wattage: 1/16W; Priority: A; PCB Footprint: R0402; Created by: YTL; Part Type: НЁУГєсД¤µзЧи; RK PN: RC0402JR-072R2L
R8423 = RESISTOR_Dup1: НЁУГєсД¤µзЧи,33R,+/-5%,R0201,1/20W.; Part Reference: R8423; Manufacturer: YAGEO; RK PN: RC0201JR-0733RL; Priority: A; Wattage: 1/20W; Value: 33R; Part Type: НЁУГєсД¤µзЧи; Manufacturer PN: RC0201JR-0733RL; Created by: YTL
R8424 = RESISTOR_Dup1: НЁУГєсД¤µзЧи,33R,+/-5%,R0201,1/20W.; Part Reference: R8424; Manufacturer: YAGEO; RK PN: RC0201JR-0733RL; Priority: A; Wattage: 1/20W; Value: 33R; Part Type: НЁУГєсД¤µзЧи; Manufacturer PN: RC0201JR-0733RL; Created by: YTL
R8425 = RESISTOR_Dup1: НЁУГєсД¤µзЧи,49R9,+/-1%,R0201,1/20W.; Part Reference: R8425; Manufacturer: YAGEO; Value: 49.9R; RK PN: RC0201FR-0749R9L; Priority: A; Wattage: 1/20W; Part Type: НЁУГєсД¤µзЧи; Manufacturer PN: RC0201FR-0749R9L; Created by: YTL
R8426 = RESISTOR_Dup1: НЁУГєсД¤µзЧи,49R9,+/-1%,R0201,1/20W.; Part Reference: R8426; Manufacturer: YAGEO; Value: 49.9R; RK PN: RC0201FR-0749R9L; Priority: A; Wattage: 1/20W; Part Type: НЁУГєсД¤µзЧи; Manufacturer PN: RC0201FR-0749R9L; Created by: YTL
R8427 = RESISTOR_Dup1: НЁУГєсД¤µзЧи,100K,+/-5%,R0402,1/16W.; Part Reference: R8427; Manufacturer: YAGEO; RK PN: RC0402JR-07100KL; Priority: A; Wattage: 1/16W; PCB Footprint: R0402; Value: 100K; Part Type: НЁУГєсД¤µзЧи; Manufacturer PN: RC0402JR-07100KL; Created by: YTL
R8428 = RESISTOR_Dup1: НЁУГєсД¤µзЧи,100K,+/-5%,R0402,1/16W.; Part Reference: R8428; Manufacturer PN: RC0402JR-07100KL; Manufacturer: YAGEO; Wattage: 1/16W; Priority: A; PCB Footprint: R0402; Value: 100K; Created by: YTL; Part Type: НЁУГєсД¤µзЧи; RK PN: RC0402JR-07100KL
R8429 = RESISTOR_Dup1: НЁУГєсД¤µзЧи,10K,+/-5%,R0402,1/16W.; Part Reference: R8429; Manufacturer PN: RC0402JR-0710KL; Manufacturer: YAGEO; Wattage: 1/16W; Priority: A; PCB Footprint: R0402; Value: 10K; Created by: YTL; Part Type: НЁУГєсД¤µзЧи; RK PN: RC0402JR-0710KL
R8430 = RESISTOR_Dup1: НЁУГєсД¤µзЧи,232K,+/-1%,R0402,1/16W.; Part Reference: R8430; Manufacturer: YAGEO; RK PN: RC0402FR-07232KL; Priority: A; Wattage: 1/16W; PCB Footprint: R0402; Value: 232K; Part Type: НЁУГєсД¤µзЧи; Manufacturer PN: RC0402FR-07232KL; Created by: YTL
R8431 = RESISTOR_Dup1: Did Not Place.; Part Reference: R8431; Value: DNP; RK PN: DNPR0402; Priority: A; PCB Footprint: R0402; Part Type: DNP; Manufacturer PN: DNPR0402; Created by: JJJ
R8432 = RESISTOR_Dup1: НЁУГєсД¤µзЧи,10K,+/-5%,R0402,1/16W.; Part Reference: R8432; Manufacturer PN: RC0402JR-0710KL; Manufacturer: YAGEO; Wattage: 1/16W; Priority: A; PCB Footprint: R0402; Value: 10K; Created by: YTL; Part Type: НЁУГєсД¤µзЧи; RK PN: RC0402JR-0710KL
R8433 = RESISTOR_Dup1: НЁУГєсД¤µзЧи,49K9,+/-1%,R0402,1/16W.; Part Reference: R8433; Manufacturer PN: RC0402FR-0749K9L; Manufacturer: YAGEO; Value: 49.9K; Wattage: 1/16W; Priority: A; PCB Footprint: R0402; Created by: YTL; Part Type: НЁУГєсД¤µзЧи; RK PN: RC0402FR-0749K9L
R8434 = RESISTOR_Dup1: НЁУГєсД¤µзЧи,10K,+/-5%,R0402,1/16W.; Part Reference: R8434; Manufacturer: YAGEO; RK PN: RC0402JR-0710KL; Priority: A; Wattage: 1/16W; PCB Footprint: R0402; Value: 10K; Part Type: НЁУГєсД¤µзЧи; Manufacturer PN: RC0402JR-0710KL; Created by: YTL
R8435 = RESISTOR_Dup1: НЁУГєсД¤µзЧи,51K,+/-5%,R0402,1/16W.; Part Reference: R8435; Manufacturer PN: RC0402JR-0751KL; Manufacturer: YAGEO; Wattage: 1/16W; Priority: A; PCB Footprint: R0402; Value: 51K; Created by: YTL; Part Type: НЁУГєсД¤µзЧи; RK PN: RC0402JR-0751KL
U8400 = PI6C557-05BLE_0: Part Reference: U8400; Value: PI6C557-05BLE
U8401 = LDO_PT5108: High-PSRR 600mA LDO.Output3.3V.; Part Reference: U8401; Manufacturer: PowtechЈЁ»ЄИуОщНюЈ©; Value: PT5108E23E-33; Priority: A; PCB Footprint: SOT_23_5; Created by: JJJ; Manufacturer PN: PT5108E23E-33; Part Type: LDO; RK PN: PT5108E23E-33
U8402 = DCDC_SY8113: Part Reference: U8402; Manufacturer PN: SY8113B; Manufacturer: SilergyЈЁОщБ¦ЅЬЈ©; Value: SY8113B/SM8103ADC; Priority: A; PCB Footprint: SOT_23_6; Created by: JJJ; Part Type: DCDC; RK PN: SY8113B
Y8400 = CRYSTAL_4P: ОЮФґѕ§ХсЈ¬25MЈ¬3225,ЎА10ppmЈ¬10pFЈ¬Hosonic; Part Reference: Y8400; Manufacturer: Hosonic(єиРЗµзЧУ); Value: 25MHz; RK PN: E3SB25.0000F10E11; Priority: A; Part Type: CRYSTAL; Manufacturer PN: E3SB25.0000F10E11; Created by: JJJ

## Sheet 90.IR Receiver_LED.SchDoc
size 297 x 209 mm; Revision: V2.1; Schematic Page Number: 11; Page Number: 37; Check: Default; Schematic Name: RK_NVR_DEMO1_RK3588_LP4/4x_V21; Page Count: 43; Page name: 90.IR Receiver/LED; Designer: Zhangdz; Schematic Page Count: 99; Revcode: V2.1; DsnPath: E:\Work\SBER\RK3588_SOM\temp\RK_NVR_DEMO1_RK3588_LP4XD200P232SD8_V21_20211228.DSN; SchematicName: RK_NVR_DEMO1_RK3588_LP4/4x_V21; PageName: 90.IR Receiver/LED; PageSize: A4; TopSchematic: True
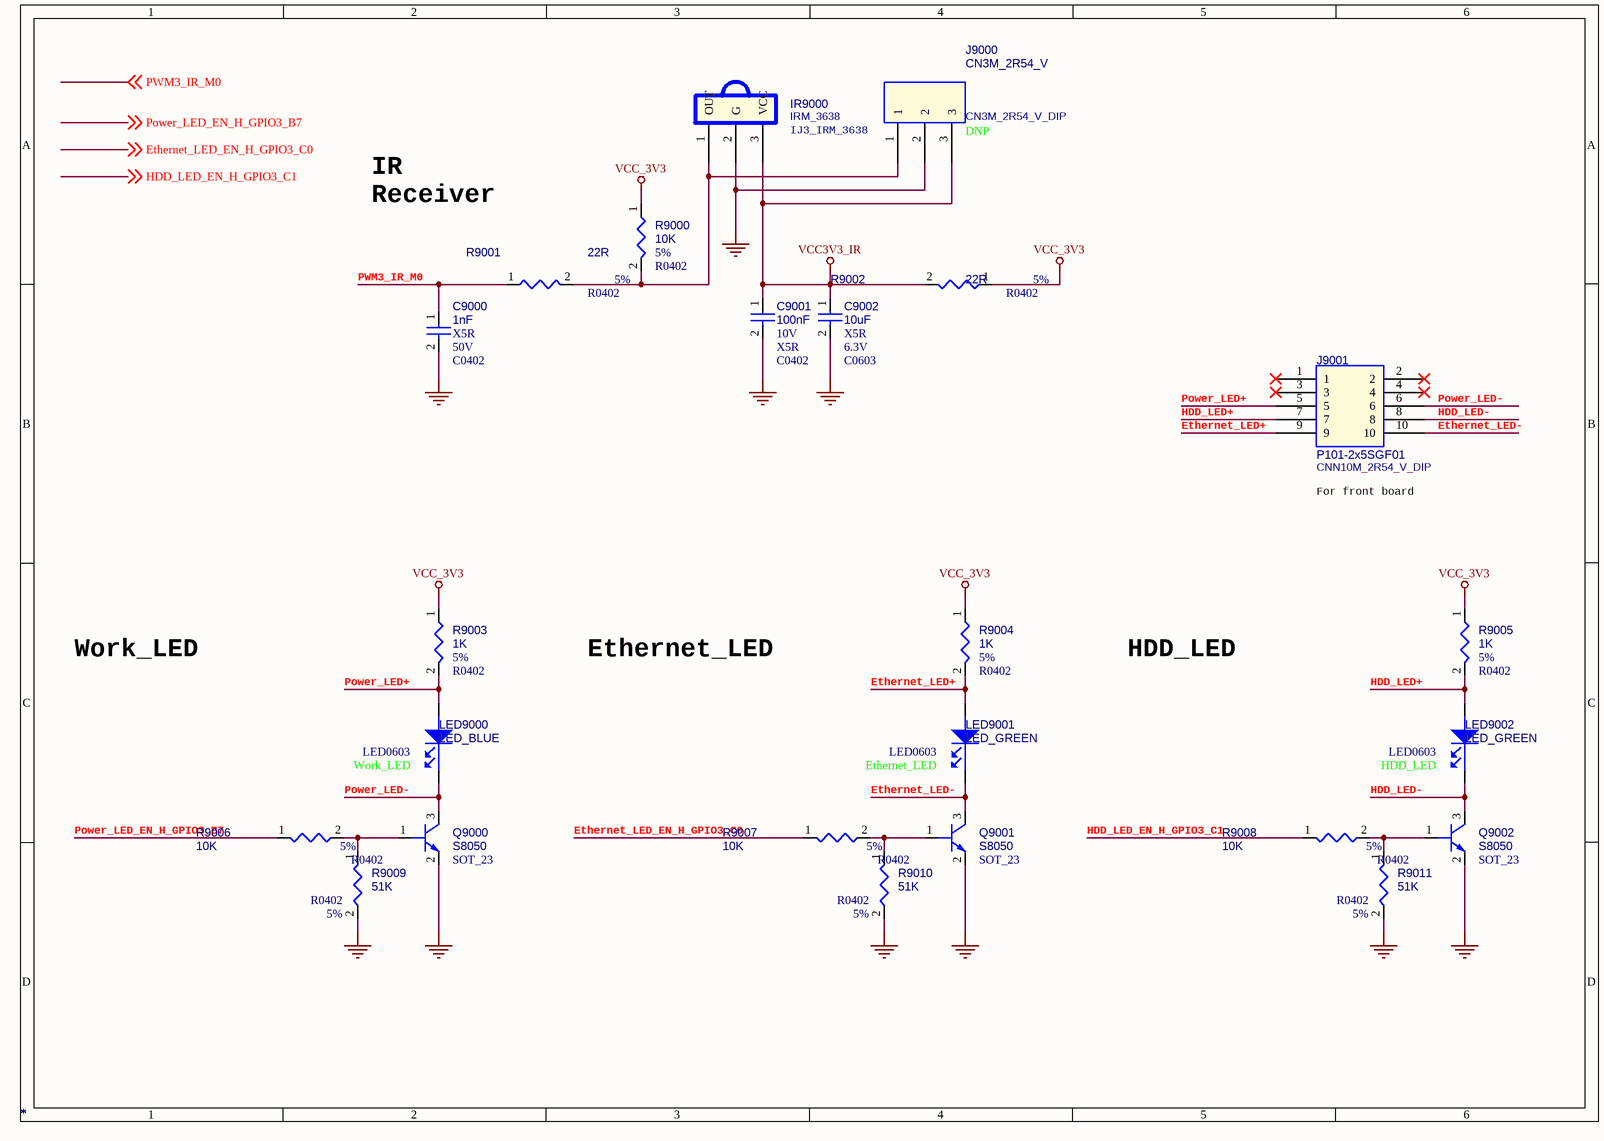
[diagram p73: 90.IR Receiver_LED.SchDoc]

### Parts
C9000  *  Voltage: 50V  Dielectric: X5R  [C0402]
C9001  *  Voltage: 10V  Dielectric: X5R  [C0402]
C9002  *  Voltage: 6.3V  Dielectric: X5R  [C0603]
IR9000  *  PCB Footprint: IJ3_IRM_3638  [IR3DIP]
J9000  *  PCB Footprint: CN3M_2R54_V_DIP  option: DNP  [DIP3_1X3_2R54]
J9001  *  PCB Footprint: CNN10M_2R54_V_DIP  [JTAG_2X10_2R54]
LED9000  *  option: Work_LED  [LED0603]
LED9001  *  option: Ethernet_LED  [LED0603]
LED9002  *  option: HDD_LED  [LED0603]
Q9000  *  [SOT_23]
Q9001  *  [SOT_23]
Q9002  *  [SOT_23]
R9000  *  Tolerance: 5%  [R0402]
R9001  *  Tolerance: 5%  [R0402]
R9002  *  Tolerance: 5%  [R0402]
R9003  *  Tolerance: 5%  [R0402]
R9004  *  Tolerance: 5%  [R0402]
R9005  *  Tolerance: 5%  [R0402]
R9006  *  Tolerance: 5%  [R0402]
R9007  *  Tolerance: 5%  [R0402]
R9008  *  Tolerance: 5%  [R0402]
R9009  *  Tolerance: 5%  [R0402]
R9010  *  Tolerance: 5%  [R0402]
R9011  *  Tolerance: 5%  [R0402]

### Nets
GND: C9000.2 C9001.2 C9002.2 IR9000.2(G) J9000.2 Q9000.2(EMITTER) Q9001.2(EMITTER) Q9002.2(EMITTER) R9009.2 R9010.2 R9011.2
VCC3V3_IR: C9001.1 C9002.1 IR9000.3(VCC) J9000.3 R9002.2
VCC_3V3: R9000.1 R9002.1 R9003.1 R9004.1 R9005.1
Ethernet_LED+: J9001.9 LED9001.1(ANODE) R9004.2
Ethernet_LED-: J9001.10 LED9001.2(CATHODE) Q9001.3(COLLECTOR)
Ethernet_LED_EN_H_GPIO3_C0: R9007.1 ; off-sheet Ethernet_LED_EN_H_GPIO3_C0
HDD_LED+: J9001.7 LED9002.1(ANODE) R9005.2
HDD_LED-: J9001.8 LED9002.2(CATHODE) Q9002.3(COLLECTOR)
HDD_LED_EN_H_GPIO3_C1: R9008.1 ; off-sheet HDD_LED_EN_H_GPIO3_C1
Power_LED+: J9001.5 LED9000.1(ANODE) R9003.2
Power_LED-: J9001.6 LED9000.2(CATHODE) Q9000.3(COLLECTOR)
Power_LED_EN_H_GPIO3_B7: R9006.1 ; off-sheet Power_LED_EN_H_GPIO3_B7
PWM3_IR_M0: C9000.1 R9001.1 ; off-sheet PWM3_IR_M0
NetIR9000_1: IR9000.1(OUT) J9000.1 R9000.2 R9001.2
NetQ9000_1: Q9000.1(BASE) R9006.2 R9009.1
NetQ9001_1: Q9001.1(BASE) R9007.2 R9010.1
NetQ9002_1: Q9002.1(BASE) R9008.2 R9011.1

Not connected (* = marked no-connect by the designer): J9001 1* 2* 3* 4*

### Notes on the sheet
- IR
  Receiver
- For front board
- Work_LED
- Ethernet_LED
- HDD_LED

### Library data of the parts
C9000 = CAP NP: cap,1.00nF,+/-10%,50V,X5R,C0402; Part Reference: C9000; Manufacturer PN: C1005X5R1H102K050BA; Manufacturer: TDK; Value: 1nF; Tolerance: 10%; Priority: A; PCB Footprint: C0402; Created by: JJJ; Part Type: C0402; RK PN: C1005X5R1H102K050BA
C9001 = CAP NP: cap,100.00nF,+/-10%,10V,X5R,C0402; Part Reference: C9001; Manufacturer PN: C1005X5R1A104K050BA; Manufacturer: TDK; Value: 100nF; Tolerance: 10%; Priority: A; PCB Footprint: C0402; Created by: JJJ; Part Type: C0402; RK PN: C1005X5R1A104K050BA
C9002 = CAP NP: cap,10.00uF,+/-10%,6.3V,X5R,C0603; Part Reference: C9002; Manufacturer PN: C1608X5R0J106K080AB; Manufacturer: TDK; Value: 10uF; Tolerance: 10%; Priority: A; PCB Footprint: C0603; Created by: JJJ; Part Type: C0603; RK PN: C1608X5R0J106K080AB
IR9000 = IRM_0: ємНвЅУКХН·; Part Reference: IR9000; Manufacturer: ТЪ№в; Value: IRM_3638; Priority: A; RK PN: IRM_3638; Part Type: IR; Manufacturer Part Number: IRM_3638; Created by: JJJ
J9000 = CON3_1X3: µҐЕЕ3PINЈЁјдѕа2.54mmЈ©І»ґш·А»¤ЗЅµДІеХл; Part Reference: J9000; Manufacturer: НъїЖґп; Value: CN3M_2R54_V; RK PN: CON3M_1X3_2R54_V; Priority: A; Part Type: Header; Manufacturer Part Number: CON3M_1X3_2R54_V; Created by: JJJ
J9001 = CON20_0: Л«ЕЕ10PINЈЁјдѕа2.54mmЈ©І»ґш·А»¤ЗЅµДІеХл,БўКЅЈ¬№«Чщ; Part Reference: J9001; Manufacturer: СwХэµзЧУ; Value: P101-2x5SGF01; RK PN: P101-2x10SGF01; Priority: A; Part Type: Header; Manufacturer Part Number: P101-2x10SGF01; Created by: JJJ
LED9000 = LED: МщЖ¬LEDµЖЈ¬0603Ј¬А¶Й«; Part Reference: LED9000; Value: LED_BLUE; Priority: A; PCB Footprint: LED0603; Created by: JJJ; Part Type: LED; RK PN: LED_BLUE
LED9001 = LED: МщЖ¬LEDµЖЈ¬0603Ј¬ВМЙ«; Part Reference: LED9001; Value: LED_GREEN; Priority: A; PCB Footprint: LED0603; RK PN: LED_GREEN; Part Type: LED; Created by: JJJ
LED9002 = LED: МщЖ¬LEDµЖЈ¬0603Ј¬ВМЙ«; Part Reference: LED9002; Value: LED_GREEN; Priority: A; PCB Footprint: LED0603; RK PN: LED_GREEN; Part Type: LED; Created by: JJJ
Q9000 = NPN: S8050,SOT23; Part Reference: Q9000; Manufacturer: і¤µз; Manufacturer PN: S8050_SOT23; Priority: A; Ic: 0.5A; Vceo: 25V; Pc: 0.3W; PCB Footprint: SOT_23; Value: S8050; RK PN: S8050; Part Type: NPN; Created by: JJJ
Q9001 = NPN: S8050,SOT23; Part Reference: Q9001; Manufacturer: і¤µз; Manufacturer PN: S8050_SOT23; Priority: A; Ic: 0.5A; Vceo: 25V; Pc: 0.3W; PCB Footprint: SOT_23; Value: S8050; RK PN: S8050; Part Type: NPN; Created by: JJJ
Q9002 = NPN: S8050,SOT23; Part Reference: Q9002; Manufacturer: і¤µз; Manufacturer PN: S8050_SOT23; Priority: A; Ic: 0.5A; Vceo: 25V; Pc: 0.3W; PCB Footprint: SOT_23; Value: S8050; RK PN: S8050; Part Type: NPN; Created by: JJJ
R9000 = RESISTOR_Dup1: НЁУГєсД¤µзЧи,10K,+/-5%,R0402,1/16W.; Part Reference: R9000; Manufacturer PN: RC0402JR-0710KL; Manufacturer: YAGEO; Wattage: 1/16W; Priority: A; PCB Footprint: R0402; Value: 10K; Created by: YTL; Part Type: НЁУГєсД¤µзЧи; RK PN: RC0402JR-0710KL
R9001 = RESISTOR_Dup1: НЁУГєсД¤µзЧи,22R,+/-5%,R0402,1/16W.; Part Reference: R9001; Manufacturer: YAGEO; RK PN: RC0402JR-0722RL; Priority: A; Wattage: 1/16W; PCB Footprint: R0402; Value: 22R; Part Type: НЁУГєсД¤µзЧи; Manufacturer PN: RC0402JR-0722RL; Created by: YTL
R9002 = RESISTOR_Dup1: НЁУГєсД¤µзЧи,22R,+/-5%,R0402,1/16W.; Part Reference: R9002; Manufacturer: YAGEO; RK PN: RC0402JR-0722RL; Priority: A; Wattage: 1/16W; PCB Footprint: R0402; Value: 22R; Part Type: НЁУГєсД¤µзЧи; Manufacturer PN: RC0402JR-0722RL; Created by: YTL
R9003 = RESISTOR_Dup1: НЁУГєсД¤µзЧи,1K,+/-5%,R0402,1/16W.; Part Reference: R9003; Manufacturer PN: RC0402JR-071KL; Manufacturer: YAGEO; Wattage: 1/16W; Priority: A; PCB Footprint: R0402; Value: 1K; Created by: YTL; Part Type: НЁУГєсД¤µзЧи; RK PN: RC0402JR-071KL
R9004 = RESISTOR_Dup1: НЁУГєсД¤µзЧи,1K,+/-5%,R0402,1/16W.; Part Reference: R9004; Manufacturer: YAGEO; RK PN: RC0402JR-071KL; Priority: A; Wattage: 1/16W; PCB Footprint: R0402; Value: 1K; Part Type: НЁУГєсД¤µзЧи; Manufacturer PN: RC0402JR-071KL; Created by: YTL
R9005 = RESISTOR_Dup1: НЁУГєсД¤µзЧи,1K,+/-5%,R0402,1/16W.; Part Reference: R9005; Manufacturer PN: RC0402JR-071KL; Manufacturer: YAGEO; Wattage: 1/16W; Priority: A; PCB Footprint: R0402; Value: 1K; Created by: YTL; Part Type: НЁУГєсД¤µзЧи; RK PN: RC0402JR-071KL
R9006 = RESISTOR_Dup1: НЁУГєсД¤µзЧи,10K,+/-5%,R0402,1/16W.; Part Reference: R9006; Manufacturer: YAGEO; RK PN: RC0402JR-0710KL; Priority: A; Wattage: 1/16W; PCB Footprint: R0402; Value: 10K; Part Type: НЁУГєсД¤µзЧи; Manufacturer PN: RC0402JR-0710KL; Created by: YTL
R9007 = RESISTOR_Dup1: НЁУГєсД¤µзЧи,10K,+/-5%,R0402,1/16W.; Part Reference: R9007; Manufacturer: YAGEO; RK PN: RC0402JR-0710KL; Priority: A; Wattage: 1/16W; PCB Footprint: R0402; Value: 10K; Part Type: НЁУГєсД¤µзЧи; Manufacturer PN: RC0402JR-0710KL; Created by: YTL
R9008 = RESISTOR_Dup1: НЁУГєсД¤µзЧи,10K,+/-5%,R0402,1/16W.; Part Reference: R9008; Manufacturer: YAGEO; RK PN: RC0402JR-0710KL; Priority: A; Wattage: 1/16W; PCB Footprint: R0402; Value: 10K; Part Type: НЁУГєсД¤µзЧи; Manufacturer PN: RC0402JR-0710KL; Created by: YTL
R9009 = RESISTOR_Dup1: НЁУГєсД¤µзЧи,51K,+/-5%,R0402,1/16W.; Part Reference: R9009; Manufacturer: YAGEO; RK PN: RC0402JR-0751KL; Priority: A; Wattage: 1/16W; PCB Footprint: R0402; Value: 51K; Part Type: НЁУГєсД¤µзЧи; Manufacturer PN: RC0402JR-0751KL; Created by: YTL
R9010 = RESISTOR_Dup1: НЁУГєсД¤µзЧи,51K,+/-5%,R0402,1/16W.; Part Reference: R9010; Manufacturer: YAGEO; RK PN: RC0402JR-0751KL; Priority: A; Wattage: 1/16W; PCB Footprint: R0402; Value: 51K; Part Type: НЁУГєсД¤µзЧи; Manufacturer PN: RC0402JR-0751KL; Created by: YTL
R9011 = RESISTOR_Dup1: НЁУГєсД¤µзЧи,51K,+/-5%,R0402,1/16W.; Part Reference: R9011; Manufacturer: YAGEO; RK PN: RC0402JR-0751KL; Priority: A; Wattage: 1/16W; PCB Footprint: R0402; Value: 51K; Part Type: НЁУГєсД¤µзЧи; Manufacturer PN: RC0402JR-0751KL; Created by: YTL

## Sheet 91.Debug UART_JTAG.SchDoc
size 420 x 297 mm; Revision: V2.1; Schematic Page Number: 11; Page Number: 38; Check: Default; Schematic Name: RK_NVR_DEMO1_RK3588_LP4/4x_V21; Page Count: 43; Page name: 91.Debug UART/JTAG; Designer: Zhangdz; Schematic Page Count: 99; Revcode: V2.1; DsnPath: E:\Work\SBER\RK3588_SOM\temp\RK_NVR_DEMO1_RK3588_LP4XD200P232SD8_V21_20211228.DSN; SchematicName: RK_NVR_DEMO1_RK3588_LP4/4x_V21; PageName: 91.Debug UART/JTAG; PageSize: A3; TopSchematic: True
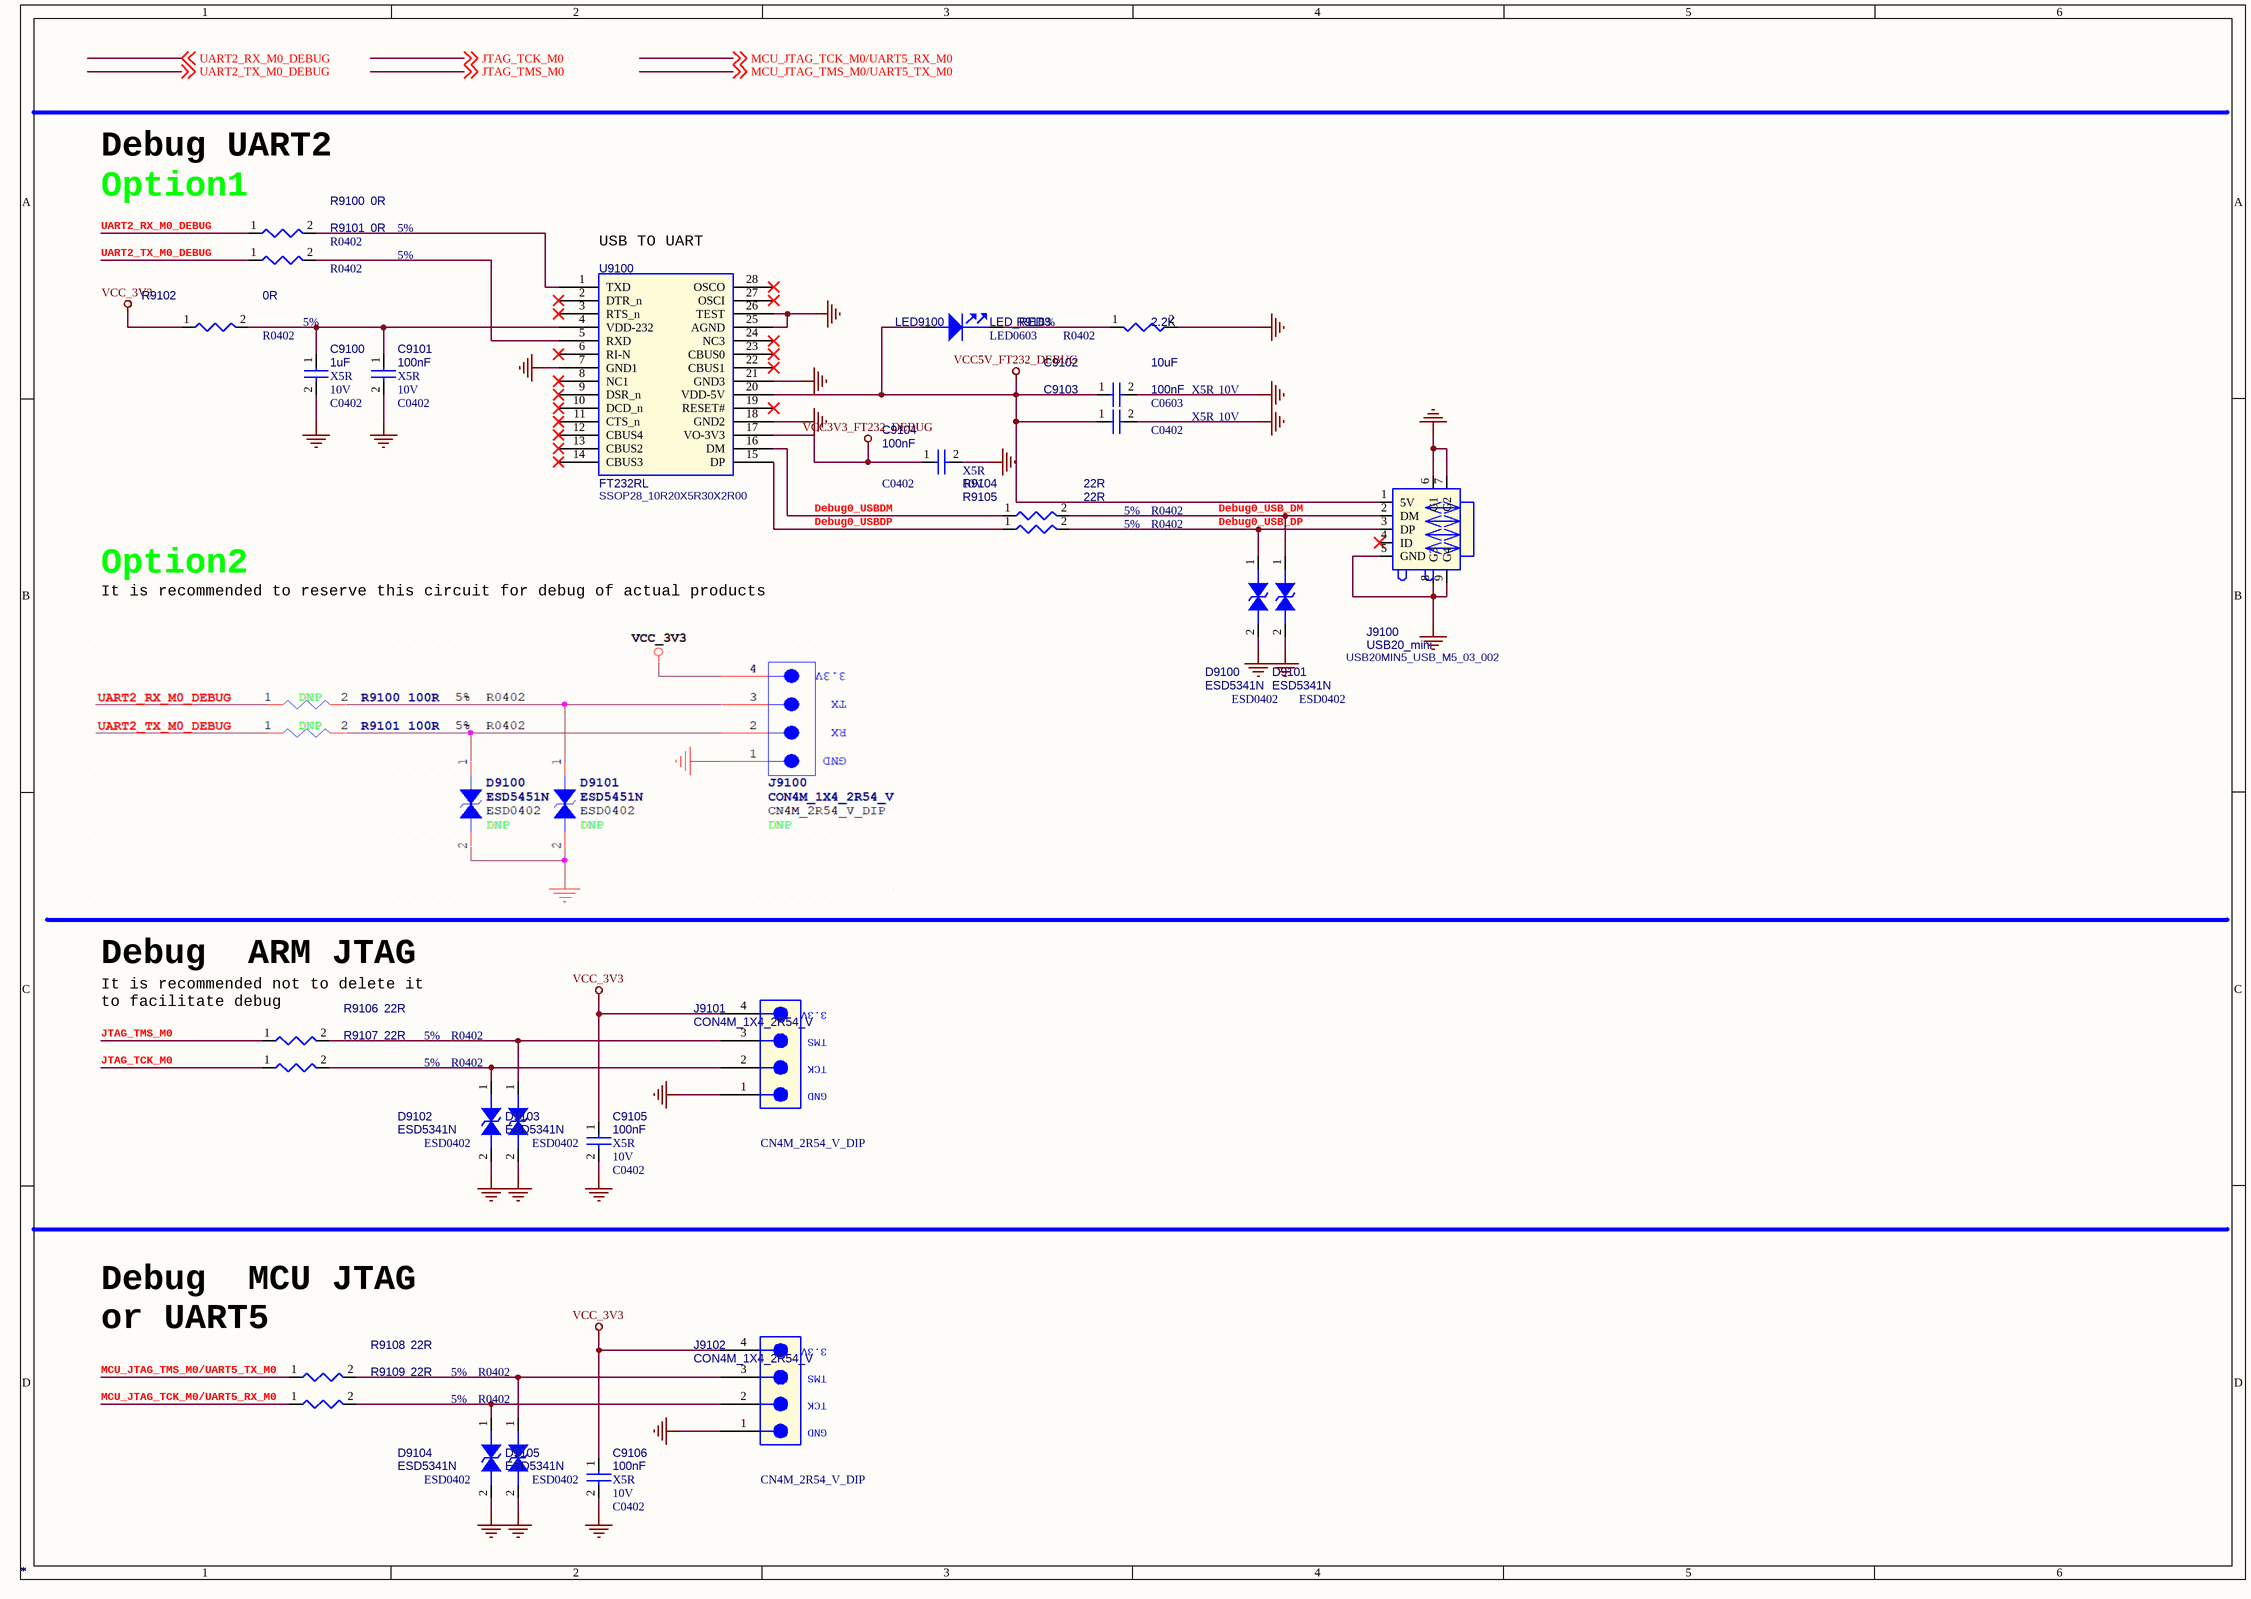
[diagram p74: 91.Debug UART_JTAG.SchDoc]

### Parts
C9100  *  Voltage: 10V  Dielectric: X5R  [C0402]
C9101  *  Voltage: 10V  Dielectric: X5R  [C0402]
C9102  *  Voltage: 10V  Dielectric: X5R  [C0603]
C9103  *  Voltage: 10V  Dielectric: X5R  [C0402]
C9104  *  Voltage: 10V  Dielectric: X5R  [C0402]
C9105  *  Voltage: 10V  Dielectric: X5R  [C0402]
C9106  *  Voltage: 10V  Dielectric: X5R  [C0402]
D9100  *  [ESD0402]
D9101  *  [ESD0402]
D9102  *  [ESD0402]
D9103  *  [ESD0402]
D9104  *  [ESD0402]
D9105  *  [ESD0402]
J9100  *  [USB20MIN5_USB_M5_03_002]
J9101  *  [CN4M_2R54_V_DIP]
J9102  *  [CN4M_2R54_V_DIP]
LED9100  *  [LED0603]
R9100  *  Tolerance: 5%  [R0402]
R9101  *  Tolerance: 5%  [R0402]
R9102  *  Tolerance: 5%  [R0402]
R9103  *  Tolerance: 5%  [R0402]
R9104  *  Tolerance: 5%  [R0402]
R9105  *  Tolerance: 5%  [R0402]
R9106  *  Tolerance: 5%  [R0402]
R9107  *  Tolerance: 5%  [R0402]
R9108  *  Tolerance: 5%  [R0402]
R9109  *  Tolerance: 5%  [R0402]
U9100  *  PCB Footprint: SSOP28_10R20X5R30X2R00  [SSOP28]

### Nets
GND: C9100.2 C9101.2 C9102.2 C9103.2 C9104.2 C9105.2 C9106.2 D9100.2 D9101.2 D9102.2 D9103.2 D9104.2 D9105.2 J9100.5(GND) J9100.6(G1) J9100.7(G2) J9100.8(G3) J9100.9(G4) J9101.1 J9102.1 R9103.2 U9100.7(GND1) U9100.18(GND2) U9100.21(GND3) U9100.25(AGND) U9100.26(TEST)
VCC3V3_FT232_DEBUG: C9104.1 U9100.17(VO-3V3)
VCC5V_FT232_DEBUG: C9102.1 C9103.1 J9100.1(5V) LED9100.1(ANODE) U9100.20(VDD-5V)
VCC_3V3: C9105.1 C9106.1 J9101.4 J9102.4 R9102.1
Debug0_USB_DM: D9101.1 J9100.2(DM) R9104.2
Debug0_USB_DP: D9100.1 J9100.3(DP) R9105.2
Debug0_USBDM: R9104.1 U9100.16(DM)
Debug0_USBDP: R9105.1 U9100.15(DP)
JTAG_TCK_M0: R9107.1 ; off-sheet JTAG_TCK_M0
JTAG_TMS_M0: R9106.1 ; off-sheet JTAG_TMS_M0
MCU_JTAG_TCK_M0/UART5_RX_M0: R9109.1 ; off-sheet MCU_JTAG_TCK_M0/UART5_RX_M0
MCU_JTAG_TMS_M0/UART5_TX_M0: R9108.1 ; off-sheet MCU_JTAG_TMS_M0/UART5_TX_M0
UART2_RX_M0_DEBUG: R9100.1 ; off-sheet UART2_RX_M0_DEBUG
UART2_TX_M0_DEBUG: R9101.1 ; off-sheet UART2_TX_M0_DEBUG
NetC9100_1: C9100.1 C9101.1 R9102.2 U9100.4(VDD-232)
NetD9102_1: D9102.1 J9101.2(RX) R9107.2
NetD9103_1: D9103.1 J9101.3 R9106.2
NetD9104_1: D9104.1 J9102.2(RX) R9109.2
NetD9105_1: D9105.1 J9102.3 R9108.2
NetLED9100_2: LED9100.2(CATHODE) R9103.1
NetR9100_2: R9100.2 U9100.1(TXD)
NetR9101_2: R9101.2 U9100.5(RXD)

Not connected (* = marked no-connect by the designer): J9100 4(ID)*; U9100 2(DTR_n)* 3(RTS_n)* 6(RI-N)* 8(NC1)* 9(DSR_n)* 10(DCD_n)* 11(CTS_n)* 12(CBUS4)* 13(CBUS2)* 14(CBUS3)* 19(RESET#)* 22(CBUS1)* 23(CBUS0)* 24(NC3)* 27(OSCI)* 28(OSCO)*

### Notes on the sheet
- Debug UART2
- Option1
- (near U9100) USB TO UART
- It is recommended to reserve this circuit for debug of actual products
- Option2
- Debug  ARM JTAG
- (near R9106) It is recommended not to delete it
  to facilitate debug
- (near R9108) Debug  MCU JTAG
  or UART5
- (in symbol HEADER 4_0) 3.3V; TMS; TCK; GND

### Library data of the parts
C9100 = CAP NP: cap,1.00uF,+/-10%,10V,X5R,C0402; Part Reference: C9100; Manufacturer PN: C1005X5R1A105K050BB; Manufacturer: TDK; Value: 1uF; Tolerance: 10%; C_Voltage: 6.3V; Priority: A; PCB Footprint: C0402; Created by: JJJ; Part Type: C0402; RK PN: C1005X5R1A105K050BB
C9101 = CAP NP: cap,100.00nF,+/-10%,10V,X5R,C0402; Part Reference: C9101; Manufacturer: TDK; Value: 100nF; RK PN: C1005X5R1A104K050BA; Priority: A; Tolerance: 10%; PCB Footprint: C0402; Part Type: C0402; Manufacturer PN: C1005X5R1A104K050BA; Created by: JJJ
C9102 = CAP NP: cap,10.00uF,+/-10%,10V,X5R,C0603; Part Reference: C9102; Manufacturer: TDK; Value: 10uF; RK PN: C1608X5R1A106K080AC; Priority: A; Tolerance: 10%; PCB Footprint: C0603; Part Type: C0603; Manufacturer PN: C1608X5R1A106K080AC; Created by: JJJ
C9103 = CAP NP: cap,100.00nF,+/-10%,10V,X5R,C0402; Part Reference: C9103; Manufacturer: TDK; Value: 100nF; RK PN: C1005X5R1A104K050BA; Priority: A; Tolerance: 10%; PCB Footprint: C0402; Part Type: C0402; Manufacturer PN: C1005X5R1A104K050BA; Created by: JJJ
C9104 = CAP NP: cap,100.00nF,+/-10%,10V,X5R,C0402; Part Reference: C9104; Manufacturer PN: C1005X5R1A104K050BA; Manufacturer: TDK; Value: 100nF; Tolerance: 10%; Priority: A; PCB Footprint: C0402; Created by: JJJ; Part Type: C0402; RK PN: C1005X5R1A104K050BA
C9105 = CAP NP: cap,100.00nF,+/-10%,10V,X5R,C0402; Part Reference: C9105; Manufacturer PN: C1005X5R1A104K050BA; Manufacturer: TDK; Value: 100nF; Tolerance: 10%; Priority: A; PCB Footprint: C0402; Created by: JJJ; Part Type: C0402; RK PN: C1005X5R1A104K050BA
C9106 = CAP NP: cap,100.00nF,+/-10%,10V,X5R,C0402; Part Reference: C9106; Manufacturer PN: C1005X5R1A104K050BA; Manufacturer: TDK; Value: 100nF; Tolerance: 10%; Priority: A; PCB Footprint: C0402; Created by: JJJ; Part Type: C0402; RK PN: C1005X5R1A104K050BA
D9100 = DIODE BI_DIR TRIG: 1-Line, Bi-directional, Transient Voltage Suppressors.1pF.; Part Reference: D9100; Manufacturer: WillSemi(О¤¶ы°лµјМе); Value: ESD5341N; Priority: A; PCB Footprint: ESD0402; Created by: JJJ; Manufacturer PN: ESD5341N; Part Type: ESD_TVS; RK PN: ESD5341N
D9101 = DIODE BI_DIR TRIG: 1-Line, Bi-directional, Transient Voltage Suppressors.1pF.; Part Reference: D9101; Manufacturer: WillSemi(О¤¶ы°лµјМе); Value: ESD5341N; Priority: A; PCB Footprint: ESD0402; RK PN: ESD5341N; Part Type: ESD_TVS; Manufacturer PN: ESD5341N; Created by: JJJ
D9102 = DIODE BI_DIR TRIG: 1-Line, Bi-directional, Transient Voltage Suppressors.1pF.; Part Reference: D9102; Manufacturer: WillSemi(О¤¶ы°лµјМе); Value: ESD5341N; Priority: A; PCB Footprint: ESD0402; Created by: JJJ; Manufacturer PN: ESD5341N; Part Type: ESD_TVS; RK PN: ESD5341N
D9103 = DIODE BI_DIR TRIG: 1-Line, Bi-directional, Transient Voltage Suppressors.1pF.; Part Reference: D9103; Manufacturer: WillSemi(О¤¶ы°лµјМе); Value: ESD5341N; Priority: A; PCB Footprint: ESD0402; RK PN: ESD5341N; Part Type: ESD_TVS; Manufacturer PN: ESD5341N; Created by: JJJ
D9104 = DIODE BI_DIR TRIG: 1-Line, Bi-directional, Transient Voltage Suppressors.1pF.; Part Reference: D9104; Manufacturer: WillSemi(О¤¶ы°лµјМе); Value: ESD5341N; Priority: A; PCB Footprint: ESD0402; RK PN: ESD5341N; Part Type: ESD_TVS; Manufacturer PN: ESD5341N; Created by: JJJ
D9105 = DIODE BI_DIR TRIG: 1-Line, Bi-directional, Transient Voltage Suppressors.1pF.; Part Reference: D9105; Manufacturer: WillSemi(О¤¶ы°лµјМе); Value: ESD5341N; Priority: A; PCB Footprint: ESD0402; Created by: JJJ; Manufacturer PN: ESD5341N; Part Type: ESD_TVS; RK PN: ESD5341N
J9100 = USB20_MINI: USB2.0 MiniРНОФКЅІаІеДёЧщЈ¬Мщєё; Part Reference: J9100; Manufacturer Part Number: USB-M5-03-002; Manufacturer: НъїЖґп; Priority: A; PCB Footprint: USB20MIN5_USB_M5_03_002; Value: USB20_mini; Created by: JJJ; Part Type: USB Jack; RK PN: USB-M5-03-002
J9101 = HEADER 4_0: Part Reference: J9101; Value: CON4M_1X4_2R54_V; PCB Footprint: CN4M_2R54_V_DIP
J9102 = HEADER 4_0: Part Reference: J9102; Value: CON4M_1X4_2R54_V; PCB Footprint: CN4M_2R54_V_DIP
LED9100 = LED: МщЖ¬LEDµЖЈ¬0603Ј¬ємЙ«; Part Reference: LED9100; Value: LED_RED; Priority: A; PCB Footprint: LED0603; Created by: JJJ; Part Type: LED; RK PN: LED_RED
R9100 = RESISTOR_Dup1: НЁУГєсД¤µзЧи,0R,+/-5%,R0402,1/16W.; Part Reference: R9100; Manufacturer PN: RC0402JR-070RL; Manufacturer: YAGEO; Wattage: 1/16W; Priority: A; PCB Footprint: R0402; Value: 0R; Created by: YTL; Part Type: НЁУГєсД¤µзЧи; RK PN: RC0402JR-070RL
R9101 = RESISTOR_Dup1: НЁУГєсД¤µзЧи,0R,+/-5%,R0402,1/16W.; Part Reference: R9101; Manufacturer: YAGEO; RK PN: RC0402JR-070RL; Priority: A; Wattage: 1/16W; PCB Footprint: R0402; Value: 0R; Part Type: НЁУГєсД¤µзЧи; Manufacturer PN: RC0402JR-070RL; Created by: YTL
R9102 = RESISTOR_Dup1: НЁУГєсД¤µзЧи,0R,+/-5%,R0402,1/16W.; Part Reference: R9102; Manufacturer: YAGEO; RK PN: RC0402JR-070RL; Priority: A; Wattage: 1/16W; PCB Footprint: R0402; Value: 0R; Part Type: НЁУГєсД¤µзЧи; Manufacturer PN: RC0402JR-070RL; Created by: YTL
R9103 = RESISTOR_Dup1: НЁУГєсД¤µзЧи,2K2,+/-5%,R0402,1/16W.; Part Reference: R9103; Manufacturer PN: RC0402JR-072K2L; Manufacturer: YAGEO; Value: 2.2K; Wattage: 1/16W; Priority: A; PCB Footprint: R0402; Created by: YTL; Part Type: НЁУГєсД¤µзЧи; RK PN: RC0402JR-072K2L
R9104 = RESISTOR_Dup1: НЁУГєсД¤µзЧи,22R,+/-5%,R0402,1/16W.; Part Reference: R9104; Manufacturer: YAGEO; RK PN: RC0402JR-0722RL; Priority: A; Wattage: 1/16W; PCB Footprint: R0402; Value: 22R; Part Type: НЁУГєсД¤µзЧи; Manufacturer PN: RC0402JR-0722RL; Created by: YTL
R9105 = RESISTOR_Dup1: НЁУГєсД¤µзЧи,22R,+/-5%,R0402,1/16W.; Part Reference: R9105; Manufacturer: YAGEO; RK PN: RC0402JR-0722RL; Priority: A; Wattage: 1/16W; PCB Footprint: R0402; Value: 22R; Part Type: НЁУГєсД¤µзЧи; Manufacturer PN: RC0402JR-0722RL; Created by: YTL
R9106 = RESISTOR_Dup1: НЁУГєсД¤µзЧи,22R,+/-5%,R0402,1/16W.; Part Reference: R9106; Manufacturer: YAGEO; RK PN: RC0402JR-0722RL; Priority: A; Wattage: 1/16W; PCB Footprint: R0402; Value: 22R; Part Type: НЁУГєсД¤µзЧи; Manufacturer PN: RC0402JR-0722RL; Created by: YTL
R9107 = RESISTOR_Dup1: НЁУГєсД¤µзЧи,22R,+/-5%,R0402,1/16W.; Part Reference: R9107; Manufacturer PN: RC0402JR-0722RL; Manufacturer: YAGEO; Wattage: 1/16W; Priority: A; PCB Footprint: R0402; Value: 22R; Created by: YTL; Part Type: НЁУГєсД¤µзЧи; RK PN: RC0402JR-0722RL
R9108 = RESISTOR_Dup1: НЁУГєсД¤µзЧи,22R,+/-5%,R0402,1/16W.; Part Reference: R9108; Manufacturer: YAGEO; RK PN: RC0402JR-0722RL; Priority: A; Wattage: 1/16W; PCB Footprint: R0402; Value: 22R; Part Type: НЁУГєсД¤µзЧи; Manufacturer PN: RC0402JR-0722RL; Created by: YTL
R9109 = RESISTOR_Dup1: НЁУГєсД¤µзЧи,22R,+/-5%,R0402,1/16W.; Part Reference: R9109; Manufacturer PN: RC0402JR-0722RL; Manufacturer: YAGEO; Wattage: 1/16W; Priority: A; PCB Footprint: R0402; Value: 22R; Created by: YTL; Part Type: НЁУГєсД¤µзЧи; RK PN: RC0402JR-0722RL
U9100 = Interface_FT232RL: Single chip USB to asynchronous serial data transfer interface.; Part Reference: U9100; Manufacturer: FTDI Chip; Priority: A; Value: FT232RL; RK PN: FT232RL; Part Type: Interface; Manufacturer PN: FT232RL; Created by: JJJ